# EasyEDA Pro project Class D amp.eprj, board PCB1
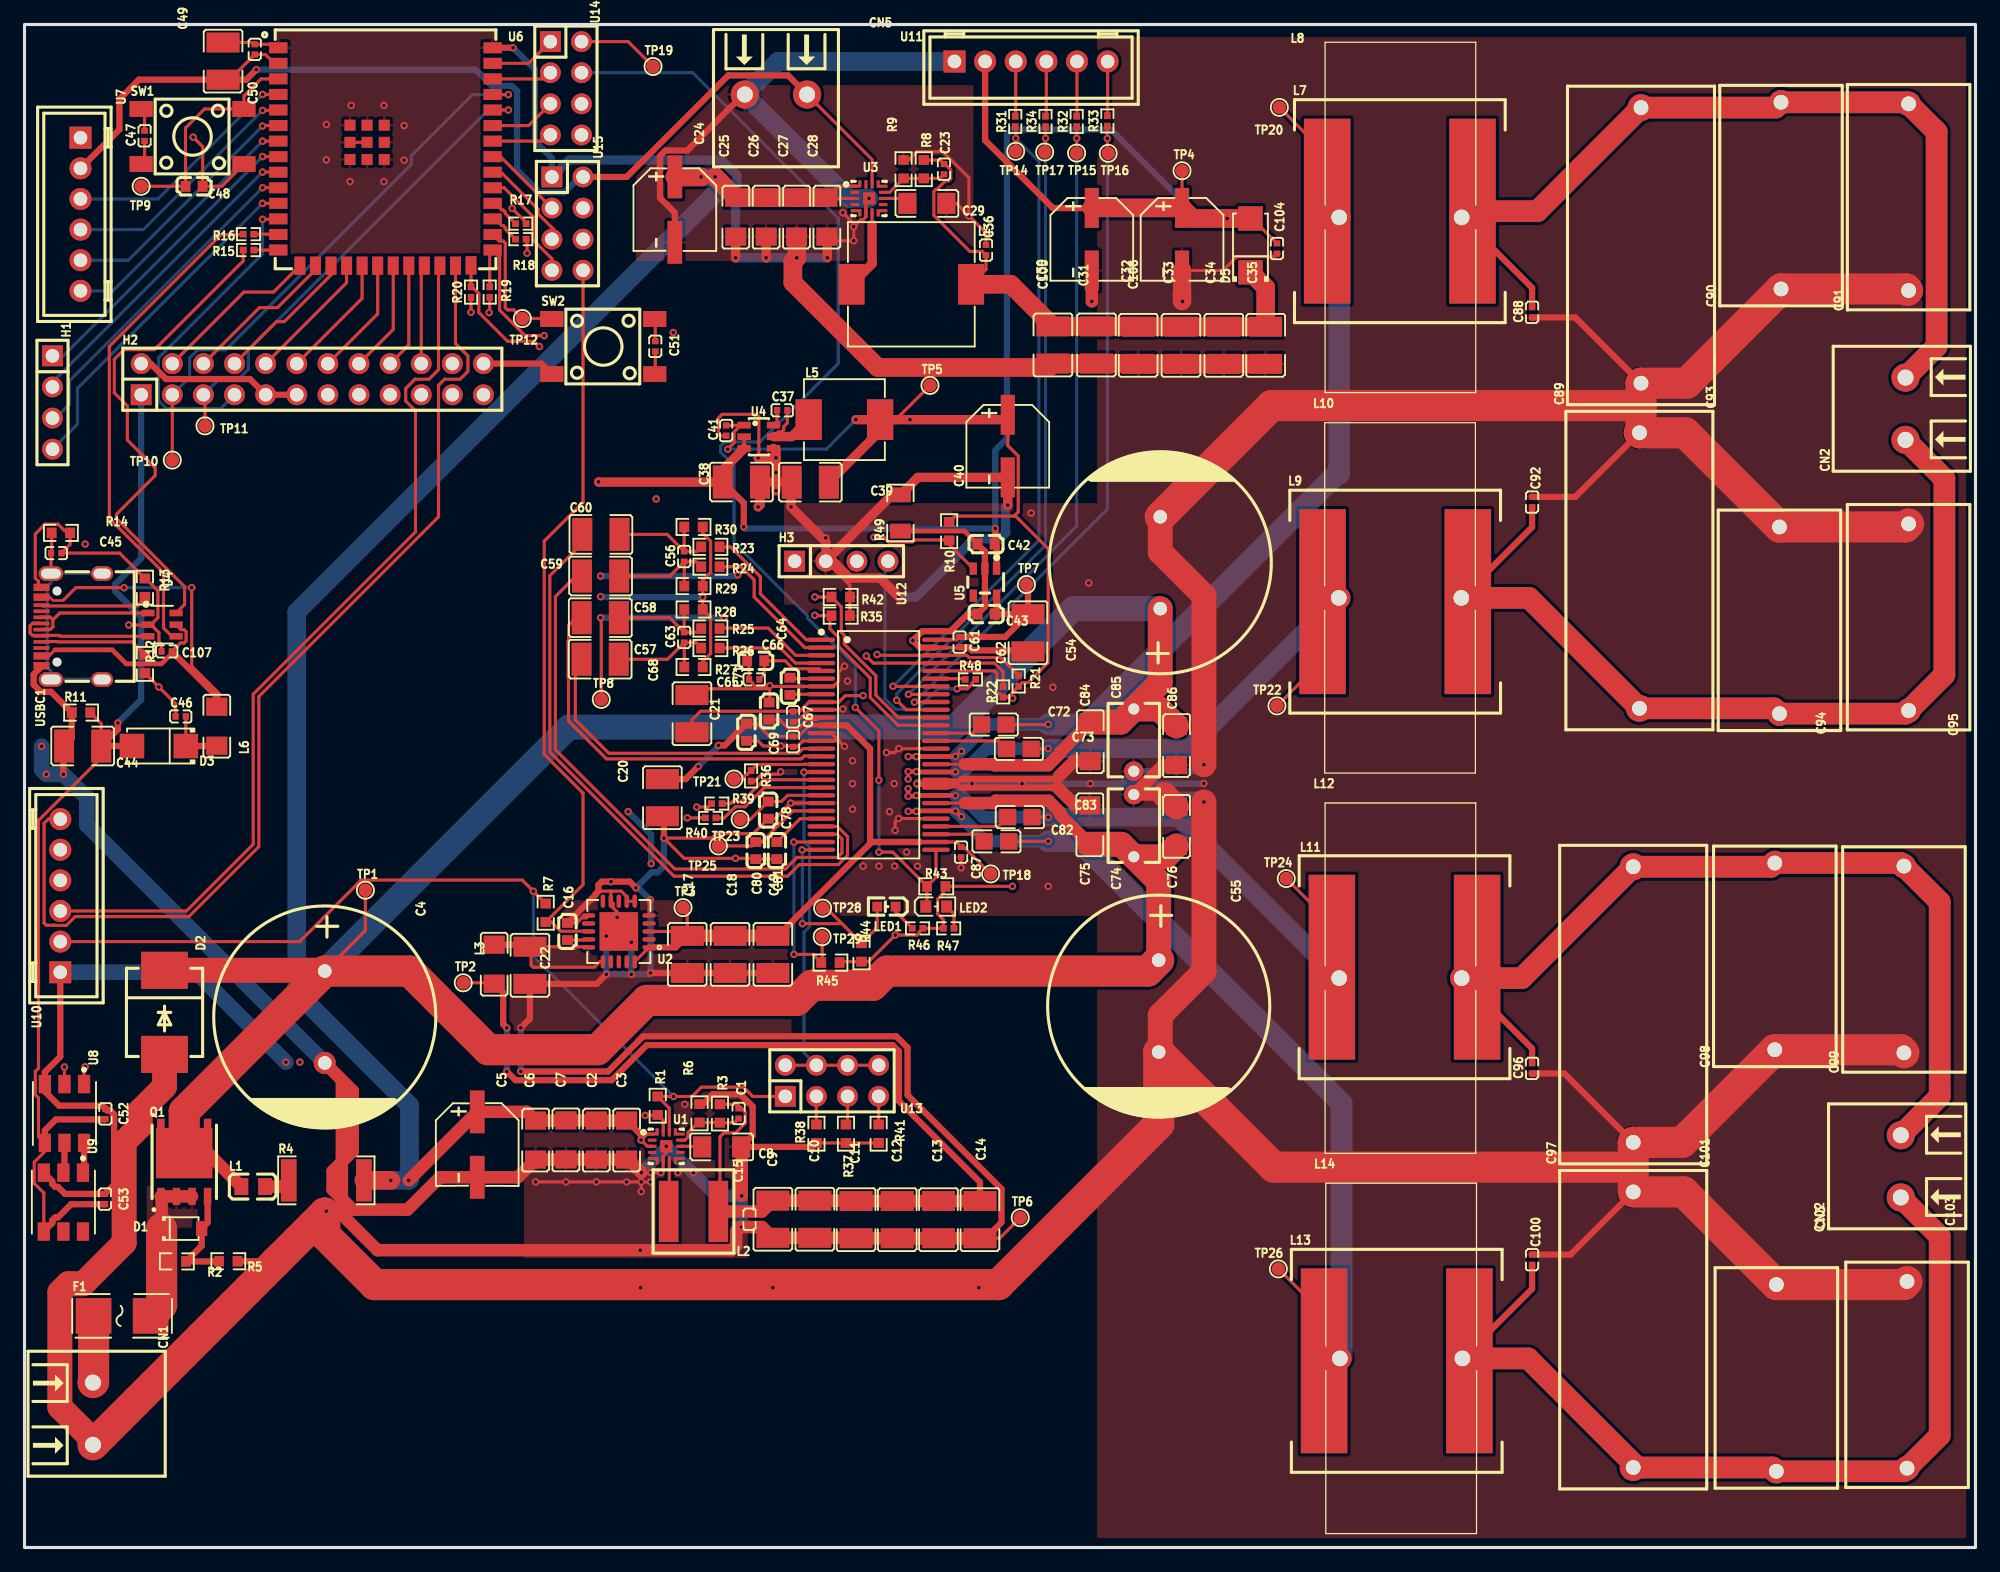
[diagram p6: board, top side]
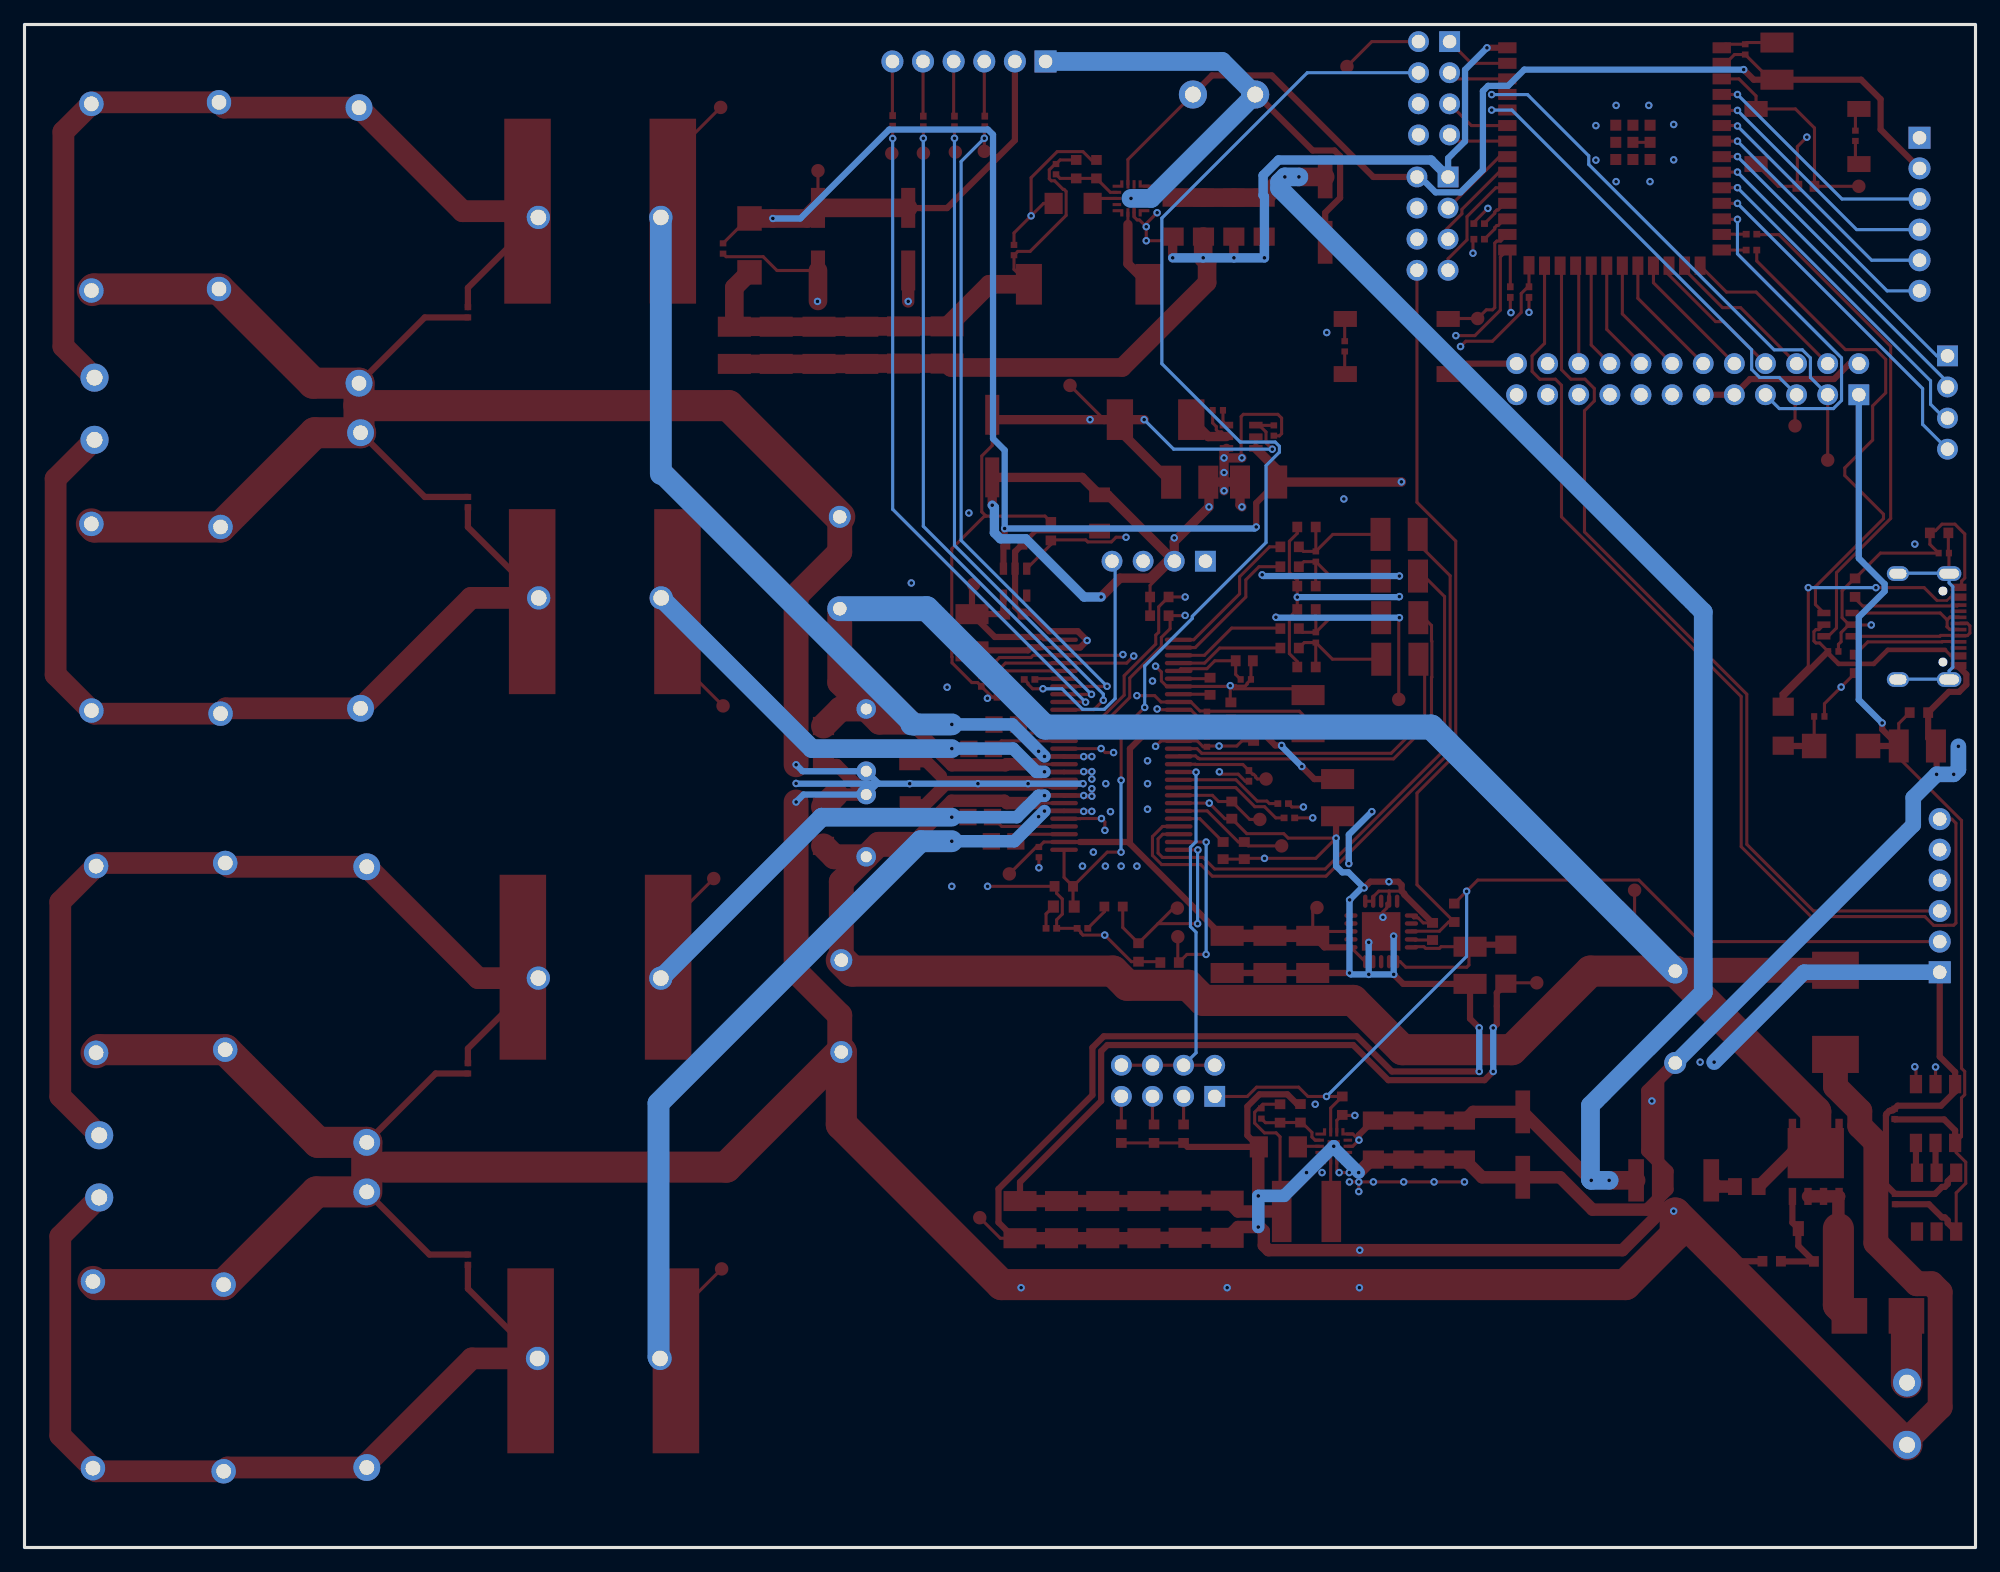
[diagram p7: board, bottom side, seen from below]

Outline 159.26 x 124.33 mm; copper layers: Top Layer, Inner1, Inner2, Bottom Layer. Coordinates in mm from the lower left corner of the outline.
Outline path: rectangle 0,124.33 159.26,0
Stack: Top Layer 0.07mm Outer layer thickness 1oz / Dielectric1 0.2104mm 7628 RC49% 8.6mil / Inner1 0.0152mm Inner layer thickness / Dielectric2 1.065mm 1.1mm H/HOZ Copper / Inner2 0.0152mm Inner layer thickness / Dielectric3 0.2104mm 7628 RC49% 8.6mil / Bottom Layer 0.07mm Outer layer thickness 1oz

## Design rules (mm)
net DSP_SCL: DP2
net DSP_SDA: DP2
net USBD+: DP1
net USBD-: DP1
net L_CKI: DP3
net L_SDI: DP3
template: Custom Config
spacing copperThickness1oz: track to track 0.102, other pairs 0.152 to 0.3
spacing copperThickness2oz (default): track to track 0.203, other pairs 0.152 to 0.3
spacing copperThicknessInner0.5oz: track to track 0.089, other pairs 0.152 to 0.3
track width copperThickness1oz: min 0.102, default 0.254, max 2.54
track width copperThickness2oz: min 0.203, default 0.254, max 2.54
track width copperThickness0.5oz (default): min 0.089, default 0.254, max 2.54
differential pair differentialPair (default): width min 0.127, default 0.254, max 2.54; gap min 0.152, default 0.152
via viaSize (default): diameter min 0.3, default 0.61, max 10; hole min 0.2, default 0.305, max 6.3

## Placement (name value [footprint] x y rotation side)
C1  10pF  [C0402]  58.29 35.43 90 top
C2  2.2uF  [C1206]  46.67 33.26 270 top
C3  2.2uF  [C1206]  49.15 33.26 270 top
C4  2200uF  [CAP-TH_BD18.0-P7.5-D0.8-FD]  24.51 43.31 270 top
C5  47uF  [CAP-SMD_BD6.3-L6.6-W6.6-LS7.2-FD]  36.96 32.89 270 top
C6  2.2uF  [C1206]  41.72 33.26 270 top
C7  2.2uF  [C1206]  44.2 33.27 270 top
C8  1uF  [C1206]  56.91 32.7 0 top
C9  10uF  [C1210]  61.09 26.8 270 top
C10  10uF  [C1210]  64.52 26.8 270 top
C11  10uF  [C1210]  67.88 26.77 270 top
C12  10uF  [C1210]  71.24 26.77 270 top
C13  10uF  [C1210]  74.61 26.77 270 top
C14  10uF  [C1210]  78 26.77 270 top
C15  100nF  [C0402]  59.18 26.8 90 top
C16  1uF  [C0603]  44.32 50.29 90 top
C17  10uF  [C1210]  54.1 48.42 270 top
C18  10uF  [C1210]  57.59 48.42 270 top
C19  10uF  [C1210]  61.09 48.42 270 top
C20  10uF  [C1210]  52.07 61.21 270 top
C21  1uF  [C0603]  58.93 66.55 270 top
C22  10uF  [C1210]  41.26 47.53 270 top
C23  10pF  [C0402]  75.06 112.52 90 top
C24  47uF  [CAP-SMD_BD6.3-L6.6-W6.6-LS7.2-FD]  53.09 109.22 270 top
C25  2.2uF  [C1206]  58.06 108.61 270 top
C26  2.2uF  [C1206]  60.54 108.61 270 top
C27  2.2uF  [C1206]  63.02 108.61 270 top
C28  2.2uF  [C1206]  65.5 108.61 270 top
C29  1uF  [C1206]  73.66 109.73 0 top
C30  10uF  [C1210]  83.95 98.17 270 top
C31  10uF  [C1210]  87.5 98.17 270 top
C32  10uF  [C1210]  90.91 98.14 270 top
C33  10uF  [C1210]  94.4 98.14 270 top
C34  10uF  [C1210]  97.9 98.14 270 top
C35  10uF  [C1210]  101.31 98.14 270 top
C36  100nF  [C0402]  78.49 105.92 270 top
C37  100nF  [C0402]  61.85 92.84 0 top
C38  10uF  [C1210]  58.52 86.98 0 top
C39  10uF  [C1210]  64.14 86.97 180 top
C40  47uF  [CAP-SMD_BD6.3-L6.6-W6.6-RD]  80.26 89.92 90 top
C41  100nF  [C0402]  57.28 91.19 90 top
C42  1uF  [C0603]  78.49 81.91 180 top
C43  1uF  [C0603]  78.5 76.2 180 top
C44  10uF  [C1210]  4.75 65.43 180 top
C45  100pF  [C0402]  2.59 81.18 180 top
C46  100nF  [C0402]  12.75 67.84 0 top
C47  100nF  [C0402]  9.8 115.25 90 top
C48  1uF  [C0603]  13.84 111.12 180 top
C49  100nF  [C0402]  18.8 122.3 270 top
C50  10uF  [C1210]  16.21 121.34 90 top
C51  100nF  [C0402]  51.49 98.06 90 top
C52  100nF  [C0402]  6.6 35.4 90 top
C53  100nF  [C0402]  6.56 28.44 90 top
C54  2200uF  [CAP-TH_BD18.0-P7.5-D0.8-FD]  92.71 80.39 90 top
C55  2200uF  [CAP-TH_BD18.0-P7.5-D0.8-FD]  92.58 44.2 270 top
C56  1nF  [C0402]  53.85 80.9 90 top
C57  10uF  [C1210]  46.99 72.52 0 top
C58  10uF  [C1210]  47 75.91 0 top
C59  10uF  [C1210]  47.03 79.31 0 top
C60  10uF  [C1210]  47.05 82.71 0 top
C61  100nF  [C0402]  76.33 73.91 90 top
C62  10uF  [C1210]  81.92 74.68 90 top
C63  1nF  [C0402]  53.85 74.3 90 top
C64  1uF  [C0603]  62.48 70.31 270 top
C65  100nF  [C0402]  59.56 70.87 0 top
C66  1uF  [C0603]  59.69 72.39 0 top
C67  100nF  [C0402]  62.74 67.82 90 top
C68  10uF  [C1210]  54.48 68.07 270 top
C69  100nF  [C0402]  62.74 65.79 90 top
C71  1uF  [C0603]  60.78 68.29 270 top
C72  33nF  [C0805]  79.12 67.18 180 top
C73  33nF  [C0805]  81.17 65.19 180 top
C74  1uF  [CAP-TH_L5.9-W4.2-P5.08-D0.5]  90.55 58.93 90 top
C75  2.2uF  [C1206]  86.96 59 90 top
C76  2.2uF  [C1206]  94.04 58.87 90 top
C78  1uF  [C0603]  60.71 60.2 90 top
C80  1uF  [C0603]  59.69 56.9 90 top
C81  22nF  [C0603]  61.42 56.9 90 top
C82  33nF  [C0805]  79.34 57.65 180 top
C83  33nF  [C0805]  81.24 59.63 180 top
C84  2.2uF  [C1206]  87 65.79 90 top
C85  1uF  [CAP-TH_L5.9-W4.2-P5.08-D0.5]  90.55 65.91 90 top
C86  2.2uF  [C1206]  94.04 65.47 90 top
C87  100nF  [C0402]  76.45 56.77 90 top
C88  1nF  [C0402]  123.06 100.84 90 top
C89  680nF  [CAP-TH_L26.0-W12.0-P22.50-D0.8]  131.95 106.3 90 top
C90  150nF  [CAP-TH_L18.0-W10.0-P15.00-D1.2]  143.38 110.36 90 top
C91  220nF  [CAP-TH_L18.3-W10.0-P15.00-D1.0]  153.8 110.24 90 top
C92  1nF  [C0402]  123.06 85.34 270 top
C93  680nF  [CAP-TH_L26.0-W12.0-P22.50-D0.8]  131.83 79.76 270 top
C94  150nF  [CAP-TH_L18.0-W10.0-P15.00-D1.2]  143.26 75.69 270 top
C95  220nF  [CAP-TH_L18.3-W10.0-P15.00-D1.0]  153.8 75.95 270 top
C96  1nF  [C0402]  123.06 39.12 90 top
C97  680nF  [CAP-TH_L26.0-W12.0-P22.50-D0.8]  131.32 44.32 90 top
C98  150nF  [CAP-TH_L18.0-W10.0-P15.00-D1.2]  142.88 48.26 90 top
C99  220nF  [CAP-TH_L18.3-W10.0-P15.00-D1.0]  153.42 48.01 90 top
C100  1nF  [C0402]  123.06 23.5 270 top
C101  680nF  [CAP-TH_L26.0-W12.0-P22.50-D0.8]  131.32 17.78 270 top
C102  150nF  [CAP-TH_L18.0-W10.0-P15.00-D1.2]  143 13.84 270 top
C103  220nF  [CAP-TH_L18.3-W10.0-P15.00-D1.0]  153.67 14.1 270 top
C104  100nF  [C0402]  102.24 106.05 90 top
C105  47uF  [CAP-SMD_BD6.3-L6.6-W6.6-RD]  87.12 106.81 90 top
C106  47uF  [CAP-SMD_BD6.3-L6.6-W6.6-RD]  94.49 106.81 90 top
C107  100nF  [C0402]  11.61 73.15 0 top
CN1  1711725  [CONN-TH_MKDS3-2-5.08]  5.59 10.92 270 top
CN2  1711725  [CONN-TH_MKDS3-2-5.08]  153.54 92.96 90 top
CN3  1711725  [CONN-TH_MKDS3-2-5.08]  153.16 31.12 90 top
CN5  1711725  [CONN-TH_MKDS3-2-5.08]  61.34 118.62 180 top
D1  MMSZ15T1G  [SOD-123_L2.7-W1.6-LS3.7-RD]  12.83 26.03 0 top
D2  SMCJ36A  [SMC_L7.1-W6.2-LS8.1-RD]  11.43 43.69 270 top
D3  SS34  [SMA_L4.3-W2.6-LS5.2-RD]  10.97 65.43 180 top
D4  USBLC6-2SC6  [SOT-23-6_L2.9-W1.6-P0.95-LS2.8-BL]  11.23 75.34 270 top
D5  SS34  [SMA_L4.3-W2.6-LS5.2-RD]  100.08 106.3 90 top
F1  0451005.MRL  [FUSE-SMD_L6.1-W2.6]  7.97 18.91 0 top
H1  PH2.54-1X4P-H25  [HDR-TH_4P-P2.54-V-M]  2.29 93.47 270 top
H2  PZ254V-12-24P  [HDR-TH_24P-P2.54-V-M-R2-C12-S2.54]  23.5 95.38 0 top
H3  PH2.54-1X4P-H25  [HDR-TH_4P-P2.54-V-M]  66.68 80.52 0 top
L1  BLM21PG300SN1D  [L0805]  18.67 29.46 0 top
L2  10uH  [IND-SMD_L6.7-W6.5]  54.61 27.43 180 top
L3  BLM31PG121SN1L  [L1206]  38.34 47.62 270 top
L4  4.7uH  [IND-SMD_L10.2-W10.0]  72.39 103.12 0 top
L5  6.8uH  [IND-SMD_L7.1-W6.6]  66.93 92.08 0 top
L6  BLM31PG121SN1L  [L1206]  15.7 67.05 90 top
L7  -  [IND-SMD_L17.2-W18.2]  112.27 109.09 0 top
L8  -  [MA5172AE]  107.31 108.58 0 top
L9  -  [IND-SMD_L17.2-W18.2]  111.89 77.22 0 top
L10  -  [MA5172AE]  107.28 77.52 0 top
L11  -  [IND-SMD_L17.2-W18.2]  112.65 47.37 0 top
L12  -  [MA5172AE]  107.31 46.48 0 top
L13  -  [IND-SMD_L17.2-W18.2]  112.01 15.24 0 top
L14  -  [MA5172AE]  107.38 15.44 0 top
LED1  KT-0603R  [LED-SMD_L1.6-W0.8-R-RD]  70.36 52.32 180 top
LED2  YLED0603YG  [LED0603-FD]  74.42 52.32 180 top
Q1  E38P100KH  [DFN-8_L6.0-W5.0-P1.27-LS6.2-BL_VBQA2309]  13.04 31.48 0 top
R1  100kΩ  [R0603]  51.69 36.07 90 top
R2  100kΩ  [R0603]  12.44 23.35 180 top
R3  100kΩ  [R0603]  56.77 35.43 90 top
R4  500mΩ  [R2512]  24.64 29.97 0 top
R5  47kΩ  [R0603]  16.64 23.37 180 top
R6  8.2kΩ  [R0603]  55.1 35.45 270 top
R7  100kΩ  [R0603]  42.55 51.82 90 top
R8  49.9kΩ  [R0603]  73.41 112.52 90 top
R9  12.4kΩ  [R0603]  71.75 112.52 270 top
R10  100kΩ  [R0603]  75.48 82.97 90 top
R11  1MΩ  [R0603]  4.62 68.16 0 top
R12  5.1kΩ  [R0603]  9.83 72.14 270 top
R13  5.1kΩ  [R0603]  9.83 78.36 90 top
R14  1MΩ  [R0603]  2.97 82.83 180 top
R15  27Ω  [R0402]  18.29 105.92 0 top
R16  27Ω  [R0402]  18.29 107.22 180 top
R17  27Ω  [R0402]  40.51 108.08 180 top
R18  27Ω  [R0402]  40.51 106.81 180 top
R19  22Ω  [R0402]  37.97 102.49 90 top
R20  22Ω  [R0402]  36.45 102.49 90 top
R21  6.8kΩ  [R0402]  81.15 70.74 90 top
R22  6.8kΩ  [R0402]  79.88 69.85 270 top
R23  499Ω  [R0603]  55.99 81.69 0 top
R24  499Ω  [R0603]  55.99 80.07 0 top
R25  499Ω  [R0603]  55.99 75.02 0 top
R26  499Ω  [R0603]  55.99 73.43 0 top
R27  100kΩ  [R0603]  54.61 71.88 180 top
R28  100kΩ  [R0603]  54.61 76.58 180 top
R29  100kΩ  [R0603]  54.61 78.49 180 top
R30  100kΩ  [R0603]  54.61 83.31 180 top
R31  22Ω  [R0402]  80.87 116.42 90 top
R32  22Ω  [R0402]  85.89 116.42 90 top
R33  22Ω  [R0402]  88.39 116.46 90 top
R34  22Ω  [R0402]  83.34 116.42 90 top
R35  10kΩ  [R0603]  66.62 76.07 180 top
R36  27kΩ  [R0402]  59.31 62.99 90 top
R37  20kΩ  [R0603]  67.06 33.78 90 top
R38  10kΩ  [R0603]  64.64 33.78 90 top
R39  22Ω  [R0402]  56.52 60.73 0 top
R40  22Ω  [R0402]  56.01 59.56 0 top
R41  30kΩ  [R0603]  69.72 33.78 90 top
R42  10kΩ  [R0603]  66.62 77.6 0 top
R43  10kΩ  [R0603]  74.42 53.97 0 top
R44  10kΩ  [R0603]  68.33 48.58 270 top
R45  10kΩ  [R0603]  65.79 47.75 0 top
R46  560Ω  [R0402]  72.9 50.55 0 top
R47  560Ω  [R0402]  75.44 50.55 180 top
R48  22Ω  [R0402]  77.22 70.87 0 top
R49  0Ω  [R1206]  71.5 84.45 90 top
SW1  PTS645SM43SMTR92LFS  [KEY-SMD_4P-L6.0-W6.0-P4.50-LS9.0]  13.72 115.19 0 top
SW2  PTS645SM43SMTR92LFS  [KEY-SMD_4P-L6.0-W6.0-P4.50-LS9.0]  47.24 98.04 0 top
TP1  -  [TESTPOINT-SMD_1P-BD1.0]  27.83 53.66 0 top
TP2  -  [TESTPOINT-SMD_1P-BD1.0]  35.81 46.1 0 top
TP3  -  [TESTPOINT-SMD_1P-BD1.0]  53.76 52.24 0 top
TP4  -  [TESTPOINT-SMD_1P-BD1.0]  94.49 112.39 0 top
TP5  -  [TESTPOINT-SMD_1P-BD1.0]  73.91 94.87 0 top
TP6  -  [TESTPOINT-SMD_1P-BD1.0]  81.28 26.92 0 top
TP7  -  [TESTPOINT-SMD_1P-BD1.0]  81.79 78.61 0 top
TP8  -  [TESTPOINT-SMD_1P-BD1.0]  47.08 69.24 0 top
TP9  -  [TESTPOINT-SMD_1P-BD1.0]  9.53 111.12 0 top
TP10  -  [TESTPOINT-SMD_1P-BD1.0]  12.07 88.77 0 top
TP11  -  [TESTPOINT-SMD_1P-BD1.0]  14.73 91.57 0 top
TP12  -  [TESTPOINT-SMD_1P-BD1.0]  40.64 100.33 0 top
TP14  -  [TESTPOINT-SMD_1P-BD1.0]  80.91 113.98 0 top
TP15  -  [TESTPOINT-SMD_1P-BD1.0]  85.88 113.84 0 top
TP16  -  [TESTPOINT-SMD_1P-BD1.0]  88.46 113.82 0 top
TP17  -  [TESTPOINT-SMD_1P-BD1.0]  83.28 113.92 0 top
TP18  -  [TESTPOINT-SMD_1P-BD1.0]  78.87 54.99 0 top
TP19  -  [TESTPOINT-SMD_1P-BD1.0]  51.31 120.9 0 top
TP20  -  [TESTPOINT-SMD_1P-BD1.0]  102.43 117.57 0 top
TP21  -  [TESTPOINT-SMD_1P-BD1.0]  57.91 62.74 0 top
TP22  -  [TESTPOINT-SMD_1P-BD1.0]  102.24 68.71 0 top
TP23  -  [TESTPOINT-SMD_1P-BD1.0]  58.42 59.44 0 top
TP24  -  [TESTPOINT-SMD_1P-BD1.0]  103 54.61 0 top
TP25  -  [TESTPOINT-SMD_1P-BD1.0]  56.64 57.28 0 top
TP26  -  [TESTPOINT-SMD_1P-BD1.0]  102.35 22.74 0 top
TP28  -  [TESTPOINT-SMD_1P-BD1.0]  65.15 52.2 0 top
TP29  -  [TESTPOINT-SMD_1P-BD1.0]  65.12 49.86 0 top
U1  LMQ66430MC3RXBRQ1  [VQFN-14_L2.6-W2.6-P0.50-BL]  52.39 32.75 0 top
U2  TPS7A4701RGWR  [VQFN-20_L5.0-W5.0-P0.65-TL-EP]  48.51 50.29 180 top
U3  LMQ66430MC3RXBRQ1  [VQFN-14_L2.6-W2.6-P0.50-BL]  68.94 110.13 0 top
U4  AP63203WU-7  [TSOT-26_L2.9-W1.6-P0.95-LS2.8-BL]  59.94 90.68 270 top
U5  TPS7A2033PDBVR  [SOT-23-5_L2.9-W1.6-P0.95-LS2.8-BR]  78.4 78.81 90 top
U6  2.4GHz  [WIRELM-SMD_ESP32-S3-WROOM-1U]  29.46 113.54 0 top
U7  B6B-XH-A(LF)(SN)  [CONN-TH_6P-P2.50_B6B-XH-A-LF-SN]  4.57 108.84 270 top
U8  SK9822  [SMD_6P-L5.0-W5.0-TL]  3.26 35.43 270 top
U9  SK9822  [SMD_6P-L5.0-W5.0-TL]  3.18 28.19 270 top
U10  B6B-XH-A(LF)(SN)  [CONN-TH_6P-P2.50_B6B-XH-A-LF-SN]  2.92 53.21 90 top
U11  B6B-XH-A(LF)(SN)  [CONN-TH_6P-P2.50_B6B-XH-A-LF-SN]  82.16 121.32 0 top
U12  TAS3251DKQR  [SSOP-56_L18.5-W7.6-P0.63-LS10.7-BL]  69.72 65.53 270 top
U13  PZ2.54-2*4  [HDR-TH_8P-P2.54-V-M-R2-C4-S2.54]  65.91 38.1 0 top
U14  PZ2.54-2*4  [HDR-TH_8P-P2.54-V-M-R2-C4-S2.54]  44.2 119.13 270 top
U15  PZ2.54-2*4  [HDR-TH_8P-P2.54-V-M-R2-C4-S2.54]  44.32 108.08 270 top
USBC1  TYPE-C-31-M-12  [USB-C_SMD-TYPE-C-31-M-12_1]  3.86 75.18 90 top

## Footprints (pads in the part's own frame, mm; a bottom-side part is the same pattern mirrored in y, then rotated)
C0402
  rect 0.5x0.54 smd: 1(-0.42,0) 2(0.42,0)
C0603
  rect 0.8x0.9 smd: 1(-0.7,0) 2(0.7,0)
C0805
  rect 1.41x1.35 smd: 1(-1,0) 2(1,0)
C1206
  rect 1.485x1.728 smd: 1(-1.593,0) 2(1.593,0)
C1210
  rect 1.635x2.7 smd: 1(-1.518,0) 2(1.518,0)
CAP-SMD_BD6.3-L6.6-W6.6-LS7.2-FD
  rect 3.5x1.2 smd: 1(-2.67,0) 2(2.67,0)
CAP-SMD_BD6.3-L6.6-W6.6-RD
  rect 3.26x1.15 smd: 1(2.555,0) 2(-2.555,0)
CAP-TH_BD18.0-P7.5-D0.8-FD
  round 1.8 hole 1.1: 1(-3.75,0) 2(3.75,0)
CAP-TH_L5.9-W4.2-P5.08-D0.5
  round 1.6 hole 0.9: 1(-2.54,0) 2(2.54,0)
CAP-TH_L18.0-W10.0-P15.00-D1.2
  round 2 hole 1.2: 1(-7.62,0) 2(7.62,0)
CAP-TH_L18.3-W10.0-P15.00-D1.0
  round 2 hole 1.2: 1(-7.62,0) 2(7.62,0)
CAP-TH_L26.0-W12.0-P22.50-D0.8
  round 2.2 hole 1.2: 1(-11.249,0) 2(11.249,0)
CONN-TH_6P-P2.50_B6B-XH-A-LF-SN
  rect 1.8x1.8 hole 1.1: 1(-6.251,0.001)
  round 1.8 hole 1.1: 2(-3.749,-0.001) 3(-1.249,-0.001) 4(1.251,-0.001) 5(3.751,-0.001) 6(6.251,-0.001)
CONN-TH_MKDS3-2-5.08
  round 2.3 hole 1.3: 1(-2.54,0) 2(2.54,0)
DFN-8_L6.0-W5.0-P1.27-LS6.2-BL_VBQA2309
  rect 0.61x1.397 smd: 1(-1.905,-2.82) 2(-0.635,-2.82) 3(0.635,-2.82) 4(1.905,-2.82) 5(1.905,2.82) 6(0.635,2.82) 7(-0.635,2.82) 8(-1.905,2.82)
  rect 4.6x4.1 smd: 9(0,0.711)
FUSE-SMD_L6.1-W2.6
  rect 2.91x2.91 smd: 1(-2.33,0) 2(2.33,0)
HDR-TH_4P-P2.54-V-M
  rect 1.7x1.7 hole 1.1: 1(-3.81,0)
  round 1.7 hole 1.1: 2(-1.27,0) 3(1.27,0) 4(3.81,0)
HDR-TH_8P-P2.54-V-M-R2-C4-S2.54
  rect 1.7x1.7 hole 1.1: 1(-3.81,-1.27)
  round 1.7 hole 1.1: 2(-3.81,1.27) 3(-1.27,-1.27) 4(-1.27,1.27) 5(1.27,-1.27) 6(1.27,1.27) 7(3.81,-1.27) 8(3.81,1.27)
HDR-TH_24P-P2.54-V-M-R2-C12-S2.54
  rect 1.7x1.7 hole 1.1: 1(-13.97,-1.27)
  round 1.7 hole 1.1: 2(-13.97,1.27) 3(-11.43,-1.27) 4(-11.43,1.27) 5(-8.89,-1.27) 6(-8.89,1.27) 7(-6.35,-1.27) 8(-6.35,1.27) 9(-3.81,-1.27) 10(-3.81,1.27) 11(-1.27,-1.27) 12(-1.27,1.27) 13(1.27,-1.27) 14(1.27,1.27) 15(3.81,-1.27) 16(3.81,1.27) 17(6.35,-1.27) 18(6.35,1.27) 19(8.89,-1.27) 20(8.89,1.27) 21(11.43,-1.27) 22(11.43,1.27) 23(13.97,-1.27) 24(13.97,1.27)
IND-SMD_L6.7-W6.5
  rect 1.6x5 smd: 1(-2.025,0) 2(2.025,0)
IND-SMD_L7.1-W6.6
  rect 2.15x3.32 smd: 1(-2.913,0) 2(2.913,0)
IND-SMD_L10.2-W10.0
  rect 2.124x3.32 smd: 1(4.878,0) 2(-4.878,0)
IND-SMD_L17.2-W18.2
  rect 3.8x15.1 smd: 1(-5.93,0) 2(5.93,0)
KEY-SMD_4P-L6.0-W6.0-P4.50-LS9.0
  rect 1.9x1.3 smd: 1(-4.2,2.25) 2(4.2,2.25) 3(-4.2,-2.25) 4(4.2,-2.25)
L0805
  rect 1.133x1.377 smd: 1(-0.966,0) 2(0.966,0)
L1206
  rect 1.485x1.728 smd: 1(-1.593,0) 2(1.593,0)
LED0603-FD
  rect 0.9x1 smd: 1(-0.85,0) 2(0.85,0)
LED-SMD_L1.6-W0.8-R-RD
  rect 0.8x0.8 smd: 1(0.75,0) 2(-0.75,0)
MA5172AE
  round 1.905 hole 1.27: 1(0,0) 2(10,0)
R0402
  rect 0.566x0.54 smd: 1(-0.433,0) 2(0.433,0)
R0603
  rect 0.806x0.864 smd: 1(-0.753,0) 2(0.753,0)
R1206
  rect 1.208x1.701 smd: 1(-1.479,0) 2(1.479,0)
R2512
  rect 1.282x3.456 smd: 1(-3.067,0) 2(3.067,0)
SMA_L4.3-W2.6-LS5.2-RD
  rect 2x2 smd: 1(-2.2,0) 2(2.2,0)
SMC_L7.1-W6.2-LS8.1-RD
  rect 3.03x3.82 smd: 1(-3.435,0) 2(3.435,0)
SMD_6P-L5.0-W5.0-TL
  rect 1.5x1 smd: 1(-2.4,1.6) 2(-2.4,0) 3(-2.4,-1.6) 4(2.4,-1.6) 5(2.4,0) 6(2.4,1.6)
SOD-123_L2.7-W1.6-LS3.7-RD
  rect 0.91x1.22 smd: 1(-1.635,0) 2(1.635,0)
SOT-23-5_L2.9-W1.6-P0.95-LS2.8-BR
  rect 1x0.6 smd: 1(1.1,-0.95) 2(1.1,0) 3(1.1,0.95) 4(-1.1,0.95) 5(-1.1,-0.95)
SOT-23-6_L2.9-W1.6-P0.95-LS2.8-BL
  rect 0.532x1.072 smd: 1(-0.95,-1.149) 2(0,-1.149) 3(0.95,-1.149) 4(0.95,1.149) 5(0,1.149) 6(-0.95,1.149)
SSOP-56_L18.5-W7.6-P0.63-LS10.7-BL
  oval 0.355x2.267 smd: 1(-8.572,-4.678) 2(-7.938,-4.678) 3(-7.303,-4.678) 4(-6.668,-4.678) 5(-6.032,-4.678) 6(-5.397,-4.678) 7(-4.763,-4.678) 8(-4.128,-4.678) 9(-3.493,-4.678) 10(-2.857,-4.678) 11(-2.223,-4.678) 12(-1.587,-4.678) 13(-0.953,-4.678) 14(-0.318,-4.678) 15(0.318,-4.678) 16(0.953,-4.678) 17(1.587,-4.678) 18(2.223,-4.678) 19(2.857,-4.678) 20(3.493,-4.678) 21(4.128,-4.678) 22(4.763,-4.678) 23(5.397,-4.678) 24(6.032,-4.678) 25(6.668,-4.678) 26(7.303,-4.678) 27(7.938,-4.678) 28(8.572,-4.678) 29(8.572,4.678) 30(7.938,4.678) 31(7.303,4.678) 32(6.668,4.678) 33(6.032,4.678) 34(5.397,4.678) 35(4.763,4.678) 36(4.128,4.678) 37(3.493,4.678) 38(2.857,4.678) 39(2.223,4.678) 40(1.587,4.678) 41(0.953,4.678) 42(0.318,4.678) 43(-0.318,4.678) 44(-0.953,4.678) 45(-1.587,4.678) 46(-2.223,4.678) 47(-2.857,4.678) 48(-3.493,4.678) 49(-4.128,4.678) 50(-4.763,4.678) 51(-5.397,4.678) 52(-6.032,4.678) 53(-6.668,4.678) 54(-7.303,4.678) 55(-7.938,4.678) 56(-8.572,4.678)
TESTPOINT-SMD_1P-BD1.0
  round 1.1 smd: 1(0,0)
TSOT-26_L2.9-W1.6-P0.95-LS2.8-BL
  rect 0.55x1.1 smd: 1(-0.95,-1.2) 2(0,-1.2) 3(0.95,-1.2) 4(0.95,1.2) 5(0,1.2) 6(-0.95,1.2)
USB-C_SMD-TYPE-C-31-M-12_1
  oval 1.2x2 hole 0.8x1.6: 1(4.325,1.706) 4(-4.325,1.706)
  oval 1.2x1.8 hole 0.8x1.4: 2(4.325,-2.474) 3(-4.325,-2.474)
  custom 0.6x1.3 smd: A1B12(-3.2,2.474) A4B9(-2.4,2.474) B1A12(3.2,2.474) B4A9(2.401,2.474)
  rect 0.3x1.3 smd: A5(-1.25,2.474) A6(-0.25,2.474) A7(0.25,2.474) A8(1.25,2.474) B5(1.75,2.474) B6(0.75,2.474) B7(-0.75,2.474) B8(-1.75,2.474)
VQFN-14_L2.6-W2.6-P0.50-BL
  custom 0.88x0.6 smd: 1(-1.06,1.005) 5(-1.06,-1) 8(1.06,-1) 12(1.06,1)
  rect 0.7x0.25 smd: 2(-1.15,0.5) 3(-1.15,0) 4(-1.15,-0.5) 9(1.15,-0.5) 10(1.15,0) 11(1.15,0.5)
  rect 0.25x0.7 smd: 6(-0.25,-1.147) 7(0.25,-1.147) 13(0.25,1.147) 14(-0.25,1.147)
  rect 1x1 smd: 15(0,0.003)
VQFN-20_L5.0-W5.0-P0.65-TL-EP
  oval 1.087x0.364 smd: 1(-2.469,1.3) 2(-2.469,0.65) 3(-2.469,0) 4(-2.469,-0.65) 5(-2.469,-1.3) 11(2.469,-1.3) 12(2.469,-0.65) 13(2.469,0) 14(2.469,0.65) 15(2.469,1.3)
  oval 0.364x1.087 smd: 6(-1.3,-2.469) 7(-0.65,-2.469) 8(0,-2.469) 9(0.65,-2.469) 10(1.3,-2.469) 16(1.3,2.469) 17(0.65,2.469) 18(0,2.469) 19(-0.65,2.469) 20(-1.3,2.469)
  rect 3.15x3.15 smd: 21(0,0)
WIRELM-SMD_ESP32-S3-WROOM-1U
  rect 1.5x0.9 smd: 1(-8.75,8.895) 2(-8.75,7.625) 3(-8.75,6.355) 4(-8.75,5.085) 5(-8.75,3.815) 6(-8.75,2.545) 7(-8.75,1.275) 8(-8.75,0.005) 9(-8.75,-1.265) 10(-8.75,-2.535) 11(-8.75,-3.805) 12(-8.75,-5.075) 13(-8.75,-6.345) 14(-8.75,-7.615) 27(8.75,-7.615) 28(8.75,-6.345) 29(8.75,-5.075) 30(8.75,-3.805) 31(8.75,-2.535) 32(8.75,-1.265) 33(8.75,0.005) 34(8.75,1.275) 35(8.75,2.545) 36(8.75,3.815) 37(8.75,5.085) 38(8.75,6.355) 39(8.75,7.625) 40(8.75,8.895)
  rect 0.9x1.5 smd: 15(-6.985,-8.895) 16(-5.715,-8.895) 17(-4.445,-8.895) 18(-3.175,-8.895) 19(-1.905,-8.895) 20(-0.635,-8.895) 21(0.635,-8.895) 22(1.905,-8.895) 23(3.175,-8.895) 24(4.445,-8.895) 25(5.715,-8.895) 26(6.985,-8.865)
  rect 0.9x0.9 smd: 41(-2.9,2.575) 41(-2.9,1.175) 41(-2.9,-0.225) 41(-1.5,2.575) 41(-1.5,1.175) 41(-1.5,-0.225) 41(-0.1,2.575) 41(-0.1,1.175) 41(-0.1,-0.225)

## Nets
As in the schematic, except:
$5N11628: C78.2 TP23.1 U12.21
$5N11697: C80.2 TP25.1 U12.23
$5N12326: C71.2 U12.11

Pads without a net: U1 2 4 5 8 9 12; U2 2 4 8 10 12 17 18 19; U3 2 4 5 8 9 12 14; U5 4; U9 5 6; USBC1 A8 B8

## Via types
v1: diameter 0.61, hole 0.305, Top Layer to Bottom Layer, 208 vias

## Routing (per net, layer and track width the routed paths; a pad name or vN(x,y) marks a point on that pad's centre or on a via; arc(x,y) is an arc through that point)
3.3V: length 402.8
  Top Layer w0.254: 80.26,69.42 R22.2 79.58,69.72 79.5,69.72 79.33,69.88 79.33,70.68 79.37,70.72 79.37,71.37 79.17,71.56 U12.52 ; 80.26,69.42 80.56,69.42 v1(80.65,69.33) ; 80.26,69.42 R21.1 81.46,70.61 81.93,70.61 83.54,72.23 83.54,72.7 83.57,72.72 83.57,81.53 80.9,84.2 80.77,84.2 ; 80.77,84.2 75.96,84.2 R10.2 ; 80.77,84.2 81.12,84.55 81.12,89.11 80.26,89.96 C40.1 ; U4.1 58.47,91.63 58.45,91.61 ; U10.2 22.46,49.46 27.48,54.49 40.63,54.49 v1(41.54,53.57) R7.2 ; 58.45,91.61 C41.2 ; 58.45,91.61 57.92,91.07 57.92,90.17 v1(57.4,89.66) ; v1(80.65,53.97) R43.2 75,53.8 75,53.4 74.54,52.94 74.54,51.71 75,51.25 R47.2 R46.2 73.03,50.24 73.03,50.16 72.86,50 v1(71.08,50) 68.91,47.83 R44.2 66.61,47.83 R45.2 ; U1.13 52.64,35.87 R1.2 v1(52.98,36.82) 54.49,36.82 55.25,37.58 58.69,37.58 59.44,36.82 62.09,36.82 U13.1 ; CN5.1 69.19,113.31 U3.13 ; 71.12,92.08 TP5.1 ; v1(68.45,69.54) 67,69.54 66.48,69.02 U12.9 64.04,69.02 63.31,68.29 62.74,68.29 62.72,68.27 55.19,68.27 54.48,67.56 C68.2 ; 16.74,119.83 C49.2 19.67,121.88 20.39,121.16 20.71,121.16 U6.2
  Top Layer w0.508: U7.2 7.75,115.76 7.75,118.24 9.34,119.83 C50.1 18.1,119.83 v1(18.92,120.65) ; U15.2 49.15,111.89 57.44,120.17 62.33,120.17 CN5.1 ; H2.2 10.29,96.65 11.54,95.39 18.4,95.39 H2.9 H2.11
  Top Layer w0.762: L5.2 69.84,91.15 C39.1 ; L5.2 v1(67.86,92.08) ; L5.2 v1(72.28,92.08) 79.87,92.08 C40.1
  Inner1 w0.254: v1(72.28,92.08) 72.28,110.22 CN5.1 ; v1(80.65,69.33) 80.65,69.32 v1(80.65,53.97)
  Inner1 w1.27: U7.2 9.53,107.63 H2.2
  Inner2 w0.254: U13.1 63.51,38.24 63.51,39.84 64.18,40.5 65.77,40.5 71.08,45.81 v1(71.08,50) ; v1(68.45,69.54) 70.66,71.75 70.66,73.01 72.95,75.3 72.95,91.41 v1(72.28,92.08)
  Bottom Layer w0.254: v1(67.86,92.08) 65.45,89.66 v1(57.4,89.66) ; v1(41.54,53.57) 41.54,48.26 v1(52.98,36.82)
  Bottom Layer w0.508: U15.2 45.33,111.89 44.07,110.63 42.04,110.63 40.21,112.46 40.21,118.91 39.79,119.32 38.16,119.32 36.83,120.65 v1(18.92,120.65)
12V_GVDD: length 68
  Top Layer w0.254: U12.12 64.08,67.12 63.16,66.21 C69.2 62.61,66.21 62.6,66.22 60.78,66.22 59.75,67.25 C21.1 ; TP18.1 76.67,57.19 C87.2 76.05,57.59 U12.30 73.12,57.59 ; U2.20 U2.1 ; TP3.1 54.1,51.89 C17.1 53.74,50.29 U2.3
  Top Layer w0.508: U12.12 67.12,67.12 69.02,65.21 69.02,57.59 ; 69.02,57.59 69.02,57.47 61.49,49.94 61.13,49.94 ; 69.02,57.59 73.12,57.59 ; U2.1 53.16,48.99 C17.1 ; v1(54.99,63.75) 53.97,62.73 C20.1 ; v1(56.64,65.48) 57.16,65.48 58.07,66.39 58.07,66.42 58.31,66.65 58.33,66.65 C21.1
  Top Layer w1.016: C19.1 C18.1 C17.1
  Bottom Layer w0.508: v1(54.99,63.75) 56.64,65.41 v1(56.64,65.48)
+3.3VA: length 15.1
  Top Layer w0.254: U12.56 76.1,74.1 C61.2
  Top Layer w0.508: C62.2 81.92,78.49 TP7.1 ; C62.2 81.91,76.2 C43.1 79.35,76.35 U5.5 ; C62.2 80.06,74.33 C61.2
+5V: length 266.2
  Top Layer w0.254: U9.4 1.58,28.95 0.8,29.73 0.8,31.46 1.58,32.24 1.58,32.94 U8.4 1.14,33.55 1.14,36.7 0.88,36.96 0.88,38.86 1.14,39.12 1.14,59.35 6.27,64.47 C44.1 6.27,67.27 R11.2 ; U4.3 U4.2 ; TP4.1 94.49,109.36 ; C104.2 100.2,108.5
  Top Layer w0.508: C53.1 3.81,28.02 2.73,26.95 2.51,26.95 2.27,26.71 2.27,26.49 U9.4 ; v1(7.62,67.31) 7.62,66.79 C44.1 D3.2 ; C52.1 6.57,34.95 2.56,34.95 1.66,34.05 U8.4 ; v1(79.25,83.19) 79.25,81.98 C42.1 79.35,81.75 79.35,79.91 ; v1(58.71,83.31) 58.71,85.27 C38.1 ; U11.2 78.41,114.88 83.95,109.35 87.11,109.35 87.12,109.36
  Top Layer w0.762: v1(46.86,86.99) 46.88,86.98 C38.1 57,87.99 U4.3
  Top Layer w1.524: D5.2 v1(98.17,108.5) 95.35,108.5 94.49,109.36 87.12,109.36
  Inner1 w0.762: H2.1 16.64,86.99 v1(46.86,86.99)
  Bottom Layer w0.508: H2.1 9.53,80.76 7.42,78.65 7.42,78.06 9.53,75.96 9.53,69.22 v1(7.62,67.31) ; v1(98.17,108.5) 95.93,108.5 88.67,115.76 80.62,115.76 80.2,115.34 80.2,90.53 79.25,89.58 v1(79.25,83.19) 58.84,83.19 v1(58.71,83.31)
+13.2V: length 92.5
  Top Layer w0.254: L2.1 56.64,27.56 56.77,27.69 56.77,33.53 57.09,33.85 58.04,33.85 58.84,34.65 58.84,35.53 58.52,35.85 C1.2 58.29,36.07 58.17,36.19 R3.2 ; TP2.1 38.26,46.1
  Top Layer w0.508: L3.2 39.08,45.29 39.08,42.71 v1(39.37,42.42) ; C14.1 78,29.83 71.37,36.45 71.37,40.51 70.87,41.02 50.8,41.02 47.93,38.15 40.08,38.15 v1(39.37,38.86)
  Top Layer w1.016: L2.1 60.2,27.43 C9.1 C10.1 67.85,28.31 C11.1 C12.1 C13.1 C14.1
  Bottom Layer w0.508: v1(39.37,42.42) v1(39.37,38.86)
AGND: length 101.5
  Top Layer w0.254: U12.55 76.3,73.47 C61.1 ; v1(55.36,77.59) R28.1 56.01,75.94 56.01,72.97 55.36,72.33 R27.1 ; TP8.1 47.08,75.85 v1(47.03,75.91) ; R30.1 55.36,82.79 56.01,82.15 56.01,79.61 55.36,78.97 R29.1 55.36,77.61 55.35,77.6
  Top Layer w0.381: R49.1 76.72,82.98 77.79,81.91
  Top Layer w0.508: 77.79,81.91 78.38,81.32 78.38,81.3 78.4,81.28 78.4,76.83 78.39,76.82 78.39,76.8 77.8,76.2 77.73,76.27 77.07,76.27 75.61,74.8 73.28,74.8 v1(72.52,74.04) 73.09,73.47 U12.55 ; C61.1 77.09,73.49 77.34,73.24 81.83,73.24 C62.1
  Inner1 w0.508: v1(55.36,77.59) 55.47,77.59 v1(57.11,75.94) 59.01,74.04 v1(72.52,74.04)
  Bottom Layer w0.508: v1(55.36,77.59) 47.07,77.59 v1(47.03,77.63) ; v1(57.11,75.94) 57.07,75.91 v1(47.03,75.91) ; v1(58.23,79.41) 58.13,79.31 v1(47.03,79.31) ; v1(49.28,60.07) 51.16,58.19 v1(51.16,55.83)
GND: length 1383.4
  Top Layer w0.254: 49.15,53.14 48.71,53.58 47.87,53.58 ; U12.37 75.56,62.04 ; C41.1 57.26,90.75 56.82,90.75 56.64,90.93 56.64,92.2 56.95,92.51 59.76,92.51 59.94,92.33 59.94,89.01 v1(59.88,88.95) ; v1(51.09,52.87) 50.98,52.76 U2.5 ; v1(70.36,64.9) 71.04,64.9 v1(71.37,65.23) 71.39,65.21 U12.42 ; v1(60.83,70.36) 60.83,69.04 C71.1 ; v1(60.83,70.36) 60.39,70.36 60.35,70.32 59.62,70.32 59.45,70.48 59.45,70.55 C65.1 59.14,72.24 C66.1 ; v1(60.83,70.36) 60.9,70.29 U12.7 66.01,70.29 66.46,70.74 66.46,71.47 v1(66.93,71.95) ; v1(60.83,70.36) 60.58,70.1 54.87,70.1 54.48,69.72 C68.1 ; 1.38,78.41 1.13,78.66 1.13,78.89 0.88,79.14 0.88,82.74 1.68,83.54 2.74,83.54 3.27,83.01 3.55,83.01 R14.1 3.72,81.89 C45.1 7.76,81.18 R13.2 9.88,79.11 10.89,78.1 10.89,75.91 10.32,75.34 10.97,74.69 10.97,73.95 11.19,73.73 11.19,73.15 ; U12.22 v1(62.55,60.77) 61.28,59.5 C78.1 59.48,58.27 56.47,58.27 56.1,57.91 v1(52.2,57.91) 53.85,56.26 v1(58.04,56.26) 59.62,56.26 C80.1 C81.1 ; C29.2 76.07,109.73 v1(77.09,108.71) ; v1(66.93,65.41) 66.48,65.85 ; 66.48,65.85 65.85,66.48 U12.13 ; 66.48,65.85 U12.14 63.53,65.85 63.05,65.37 C69.1 62.67,65.43 v1(61.75,65.43) 60.3,65.43 59.88,65.85 C21.2 ; v1(50.34,29.84) 50.35,29.85 v1(50.35,30.61) v1(51.12,30.61) v1(51.94,30.61) 52.14,30.8 U1.6 52.14,31.97 52.39,32.23 v1(52.39,32.76) ; v1(50.34,29.84) 50.34,29.84 v1(50.34,29.06) ; v1(50.34,29.84) v1(49.15,29.84) v1(46.68,29.84) v1(44.2,29.84) v1(41.72,29.84) ; v1(50.34,29.84) v1(51.11,29.84) ; C104.1 101.99,105.38 98.96,105.38 97.83,104.25 C106.2 ; 78.46,25.25 79.6,25.25 TP6.1 ; C16.2 45.08,50.99 45.49,51.4 45.86,51.4 U2.11 ; v1(67.69,107.82) v1(67.69,106.68) 65.83,106.68 65.53,106.98 ; v1(67.69,107.82) 68.25,108.38 68.43,108.38 68.69,108.63 U3.6 68.69,109.71 68.94,109.96 v1(68.94,110.13) ; v1(67.69,107.82) 67.69,108.08 v1(66.8,108.97) ; v1(8.51,75.31) 10.05,75.31 10.08,75.34 ; v1(61.72,63.32) 61.53,63.13 60.18,63.13 59.61,62.56 R36.1 ; v1(71.07,58.55) 71.07,59.23 v1(71.35,59.51) 73.08,59.51 73.09,59.5 U12.33 ; C46.1 12.33,68.88 v1(10.97,70.24) R12.2 ; v1(77.09,108.71) 77.09,111.82 74.96,113.96 72.86,113.96 72.18,113.28 R9.1 ; v1(77.09,108.71) 78.49,107.31 C36.1 ; 75.56,62.67 U12.38 ; U2.7 U2.6 ; U6.41 U6.41 ; 47.87,53.58 46.84,53.58 ; 47.87,53.58 47.86,53.58 U2.9 48.05,52.57 48.05,52.21 48.37,51.89 v1(48.37,51.45) ; SW1.4 16.1,111.12 C48.1 14.54,114.36 v1(13.77,115.14) ; v1(76.45,55.49) C87.1 ; 16.21,122.86 18.66,122.86 C49.1 20.43,122.72 U6.1 ; R38.1 R37.1 R41.1 ; R35.1 R42.2 67.38,78.55 H3.2 ; 76.2,62.67 75.69,62.67 ; 62.74,67.45 63.11,67.45 64.06,68.39 U12.10 66.74,68.39 v1(66.8,68.45)
  Top Layer w0.508: v1(40.51,38.86) 47.64,38.86 50.51,41.73 71.16,41.73 72.09,40.81 72.09,36.94 79.75,29.27 79.75,26.54 78.46,25.25 ; C89.1 126.58,100.42 C88.1 ; H2.24 42.19,96.65 43.04,95.79 ; C16.2 46.63,53.3 46.63,53.37 46.84,53.58 46.84,54.08 47.12,54.36 v1(47.88,54.36) 49.4,54.36 v1(49.91,53.85) ; v1(3.18,63.12) 3.18,65.38 C44.2 3.87,66.07 R11.1 2.17,69.85 1.34,69.85 0.75,70.44 0.75,71.28 1.39,71.91 USBC1.A1B12 ; C92.1 126.58,85.76 C93.1 ; v1(47.49,46.79) 46.72,46.01 41.26,46.01 41.26,43.17 v1(40.51,42.42) ; C100.1 126.2,23.91 C101.1 ; C97.1 125.7,38.7 C96.1 ; 20.51,23.31 20.45,23.37 R5.1 ; 75.56,62.23 76.07,62.23 ; v1(51.1,46.9) C17.2 C18.2 C19.2 ; v1(72.85,62.36) 75.56,62.36 ; C24.2 53.09,108.97 51.87,110.19 51.87,113.59 52.32,114.05 54.1,114.05 58.67,118.62 CN5.2 ; v1(39.88,122.43) 39.87,122.43 U6.40 ; R38.1 64.32,32.7 C8.2 59.44,33.64 59.44,36 58.44,37 56.17,37 55.37,36.2 R6.1 ; 76.32,62.04 84.33,62.04 ; C20.2 52.2,59.57 v1(52.2,57.91) ; U9.3 2.27,29.9 2.27,29.68 2.51,29.44 2.73,29.44 3.3,28.86 C53.2 7.31,29.61 7.31,35.27 7.28,35.31 7.28,35.4 7.04,35.64 6.95,35.64 6.9,35.69 6.73,35.69 C52.2 6.35,36.07 2.82,36.07 1.66,37.22 U8.3 1.66,38.82 2.92,40.07 U10.1 ; 75.69,62.48 76.2,62.48 ; 84.31,62.74 76.46,62.74
  Top Layer w0.762: H3.2 70.82,85.93 R49.2 72.93,87.36 C40.2 v1(80.26,85.09) ; H3.2 65.99,80.52 67.37,79.13 69.84,79.13 v1(71.37,77.6) ; H3.2 65.41,82.11 v1(62.57,84.95) 62.57,86.91 C39.2 62.61,86.98 61.34,86.98 ; v1(59.88,88.95) v1(61.34,88.95) ; v1(61.34,88.95) 61.34,89.53 U4.4 ; v1(61.34,88.95) v1(61.34,87.76) 61.34,86.98 ; 61.34,86.98 C38.2 60.04,85.1 v1(59.88,84.95) ; 61.34,86.98 v1(61.34,86.27) ; C25.2 58.04,106.99 v1(58.04,105.28) ; C26.2 60.54,105.29 v1(60.53,105.28) ; v1(65.53,105.28) 65.53,106.98 C28.2
  Top Layer w1.016: 25.91,31.48 25.91,38.03 ; 25.91,31.48 26.79,32.36 26.79,37.28 C4.2 ; 25.91,31.48 25.15,30.72 25.15,29.23 25.91,28.47 ; 25.91,31.48 25.91,28.47 ; C14.2 C13.2 C12.2 C11.2 67.85,25.28 C10.2 C9.2 60.2,26.16 v1(58.55,26.16) 58.42,26.16 58.09,25.84 58.09,24.66 57.71,24.27 v1(50.26,24.27) 28.81,24.27 25.91,27.18 25.91,28.47 ; v1(50.35,30.61) 49.29,31.67 C3.2 C2.2 44.21,31.67 C7.2 44.18,31.67 C6.2 40.27,30.22 C5.2 33.91,30.22 31.27,27.58 26.79,27.58 25.91,28.47 ; 94.49,101.77 v1(94.53,101.73) ; C8.2 58.55,32.66 v1(58.55,28.7) ; C105.2 v1(87.12,101.73) ; C84.1 85.66,64.19 84.46,62.99 ; C75.2 85.78,60.59 84.33,62.04 ; 93.03,61.47 C74.2 92.96,63.88 C86.1
  Top Layer w1.524: C27.2 63.04,106.99 v1(63.04,105.28) 62.72,104.97 62.72,103.26 69.65,96.34 83.63,96.34 C30.2 C31.2 90.88,96.65 90.91,96.63 101.31,96.63 ; C106.2 94.49,101.77
  Top Layer w2.032: v1(96.27,60.86) 96.27,47.01 92.71,43.45 92.71,40.57 C55.2 ; CN1.2 5.46,8.51 5.46,8.89 2.89,11.46 2.89,20.85 3.57,21.53 4.8,21.53 8.13,24.87 8.13,33.1 9.45,34.41 9.45,35.64 11.43,37.62 D2.2 ; 93.03,61.47 C76.2 ; C54.2 92.71,81.27 96.27,77.7 v1(96.27,63.9)
  Top Layer w2.54: C54.2 101.79,93.22 131.95,93.22 ; 131.95,93.22 C89.1 135.69,95.05 C90.1 153.59,102.74 153.72,102.62 ; 131.95,93.22 131.95,91.13 C93.1 135.56,91.01 C94.1 153.54,83.31 C95.1 ; 129.77,31.05 101.98,31.05 C55.2 92.58,34.54 79.5,21.46 28.58,21.46 24.51,25.53 24.51,27.31 CN1.2 ; C103.1 153.42,21.46 C102.1 135.44,29.03 131.44,29.03 ; C99.1 153.16,40.64 C98.1 135.31,33.07 C97.1 C101.1
  Inner2 w2.032: v1(63.04,105.28) 64.09,105.28 v1(68.94,110.13) 75.67,110.13 v1(77.09,108.71) 84.07,101.73 v1(87.12,101.73) v1(94.53,101.73)
  Inner2 w2.54: v1(21.34,39.62) v1(22.48,39.62) 22.55,39.56 C4.2 37.62,39.56 38.65,40.59 49.56,40.59 65.2,56.23 65.2,60.76 71.42,66.98 75.55,66.98 C54.2
  Bottom Layer w0.508: v1(72.85,62.36) v1(77.34,62.36) v1(81.43,62.36) v1(87,62.36) 89.53,62.36 ; v1(39.88,122.43) 41.67,120.64 41.67,114.8 43.05,113.41 U15.1 ; v1(47.5,49.91) 47.49,49.9 v1(47.49,46.79) v1(49.53,46.79) ; v1(49.53,49.4) 49.53,46.79 v1(49.53,46.79) ; 89.53,62.36 C85.1 95.75,63.37 v1(96.27,63.9) ; 89.53,62.36 89.66,62.36 ; v1(49.53,46.79) 50.99,46.79 v1(51.1,46.9) 51.1,52.86 v1(51.09,52.87) 50.11,53.85 v1(49.91,53.85) 51.18,55.12 51.69,55.12 52.2,55.63 v1(52.2,57.91) ; v1(96.27,60.86) 95.67,61.47 C74.2 89.66,62.36 ; v1(40.51,38.86) v1(40.51,42.42) ; 89.66,62.36 96.26,62.36 v1(96.27,62.37)
  Bottom Layer w0.762: v1(71.37,77.6) 72.77,77.6 77.52,82.35 79.59,82.35 80.09,82.84 80.09,84.91 v1(80.26,85.09) ; v1(65.53,105.28) v1(63.04,105.28) v1(60.53,105.28) v1(58.04,105.28) 58.04,110.29 58.15,110.39 58.15,112.02 56.9,113.27 44.44,113.27 U15.1
  Bottom Layer w1.016: v1(58.55,26.16) v1(58.55,28.7) 56.44,28.7 v1(52.39,32.76) 52.39,32.65 v1(50.35,30.61)
  Bottom Layer w1.27: v1(21.34,39.62) 14,46.96 U10.1 ; v1(1.4,65.41) 1.4,63.5 v1(1.78,63.12) v1(3.18,63.12) 5.08,61.21 5.08,58.99 C4.2
  Bottom Layer w1.524: U11.1 61.5,121.32 CN5.2 67.28,110.13 v1(68.94,110.13)
  vias: v1(24.64,116.17) v1(24.64,113.28) v1(24.64,27.46) v1(26.42,36.45) v1(26.57,111.51) v1(26.67,117.73) v1(29.34,117.73) v1(29.34,111.51) v1(30.99,116.08) v1(30.99,113.26) v1(50.29,21.21) v1(51.56,85.6) v1(52.96,99.19) v1(53.34,30.61) v1(53.9,36.19) v1(54.61,30.61) v1(61.09,21.21) v1(65.41,82.42) v1(67.18,70.74) v1(67.59,64.22) v1(67.59,62.36) v1(67.59,60.27) v1(68.45,55.63) v1(69.74,55.63) v1(70.61,60.07) v1(70.99,62.36) v1(71.03,55.63) v1(72.01,56.77) v1(72.9,55.63) v1(77.91,21.21) v1(82.17,84.45) v1(83.57,53.97) v1(83.95,70.23) v1(86.87,78.74)
PVDD: length 263.4
  Top Layer w0.254: C4.1 27.83,50.37 TP1.1 ; 76.77,60.77 U12.35 ; 76.73,63.94 U12.40
  Top Layer w1.016: 76.73,63.94 79.1,63.94 79.19,63.86 83.56,63.86 84.53,64.82 84.53,64.91 C84.2 ; C75.1 84.53,59.83 84.53,60.02 83.59,60.96 79.27,60.96 79.07,60.77 76.77,60.77 ; L1.1 14.97,32.19 Q1.9
  Top Layer w2.032: C4.1 24.45,47.12 D2.1 ; C74.1 89.53,57.4 C75.1 ; C74.1 93.15,56.39 C76.1 ; C74.1 92.58,54.36 C55.1 ; C84.2 89.48,67.38 C85.2 ; C85.2 92.71,70.61 C54.1 ; C85.2 92.65,68.45 C86.2
  Top Layer w2.54: C55.1 91.69,47.06 70.4,47.06 69.24,45.9 64.26,45.9 63.03,44.66 50.8,44.66 46.78,40.64 37.85,40.64 31.43,47.06 C4.1 13.04,35.59 Q1.9
  Bottom Layer w2.032: C4.1 44.43,66.98 75.95,66.98 85.62,76.64 C54.1
PVDDLMQ: length 146.9
  Top Layer w0.254: U3.1 66.43,111.14 C28.1 65.57,110.13 U3.3 ; 51.33,33.76 50.83,33.76 v1(50.33,33.26) 50.84,32.75 U1.3
  Top Layer w0.508: v1(50.33,33.26) 50.33,33.68 C3.1
  Top Layer w1.016: v1(31.37,29.97) C5.1 41.01,35.56 C6.1 44.18,34.85 C7.1 46.66,34.87 C2.1 C3.1
  Top Layer w1.524: R4.2 v1(29.91,29.97) ; 53.09,111.89 v1(55.23,111.89) ; v1(56.38,111.89) C25.1 C26.1 C27.1 C28.1
  Bottom Layer w1.524: v1(55.23,111.89) v1(56.38,111.89) 56.81,111.46 56.81,110.95 22.23,76.37 22.23,45.3 31.43,36.1 31.43,30.04 v1(31.37,29.97) v1(29.91,29.97)
VBUS1: length 44.7
  Top Layer w0.203: 3.18,77.34 3.14,77.31 2.33,77.31 2.06,77.58 USBC1.B4A9
  Top Layer w0.254: C107.2 12.72,73.84 13.03,73.84 13.19,74.01 13.19,74.77 13.03,74.93 12.78,74.93 D4.5 ; 2.49,73.28 2.02,72.81 1.38,72.81 ; v1(13.65,78.36) 13.65,71.95 15.88,69.72 15.88,68.82 L6.2 ; v1(8.13,78.36) 4.19,78.36 3.18,77.34
  Top Layer w0.381: 2.49,73.28 7.16,73.28 8.31,72.14 11.18,72.14 12.11,73.07
  Top Layer w0.508: L6.2 15.7,69.48 12.11,73.07 C107.2
  Bottom Layer w0.254: v1(13.65,78.36) v1(8.13,78.36)
(no net):
  vias: v1(4.95,81.91)
A+: length 73.4
  Top Layer w0.508: L8.2 123.06,102.84 C88.2
  Top Layer w1.778: L7.2 123.5,109.09 C89.2 142.95,117.55 C90.2 153.67,117.98 C91.2 156.08,115.57 156.08,98.04 CN2.2
A-: length 75
  Top Layer w0.508: C92.2 123.06,83.3 L10.2
  Top Layer w1.778: L10.2 122.81,77.52 C93.2 142.82,68.51 143.26,68.07 153.54,68.07 C95.2 156.72,71.25 156.72,87.25 CN2.1
B+: length 73.9
  Top Layer w0.508: 123.06,39.54 123.06,40.73 L12.2
  Top Layer w1.778: L12.2 122.23,46.48 C97.2 142.57,55.57 C98.2 153.16,55.88 156.34,52.7 156.34,36.83 CN3.2
B-: length 74.9
  Top Layer w0.508: L14.2 123.06,21.12 C100.2
  Top Layer w1.778: CN3.1 156.34,25.4 156.34,9.14 C103.2 153.42,6.22 C102.2 142.69,6.53 C101.2 131.32,6.86 122.74,15.44 L14.2
DN: length 11.2
  Top Layer w0.254: 1.24,75.46 0.68,75.46 0.46,75.24 0.46,74.65 0.66,74.45 1.37,74.45 1.38,74.46 2.83,74.46 2.91,74.39 10.08,74.39
DP: length 10.6
  Top Layer w0.254: 2.31,75.73 2.32,75.72 2.32,75.17 2.31,75.17 2.31,75.16 2.11,74.96 1.38,74.96 ; 2.31,75.73 2.88,76.29 10.08,76.29 ; 2.31,75.73 2.08,75.96 1.38,75.96
DSP_RESET: length 72.9
  Top Layer w0.254: U6.24 33.8,104.53 33.8,96.15 33.02,95.38 31.88,95.38 31.12,94.61 31.12,93.6 31.92,92.8 31.92,82.91 18.67,69.66 18.67,57.4 13.23,51.96 U10.3
DSP_SCL: length 63.8
  Top Layer w0.254: v1(36.45,100.84) 36.45,102.06
  Inner2 w0.254: U10.5 4.13,55.75 5.21,55.75 38.59,89.13 38.59,97.17 36.45,99.31 v1(36.45,100.84)
DSP_SDA: length 63.9
  Top Layer w0.254: v1(37.92,100.81) 37.97,100.86 37.97,102.06
  Inner2 w0.254: v1(37.92,100.81) 37.97,100.76 37.97,99.44 39,98.41 39,88.97 4.62,54.59 3.05,54.59 U10.4
DSP_SELFBOOT: length 85.5
  Top Layer w0.254: U10.6 1.93,59.46 1.6,59.13 1.6,50.98 1.78,50.8 2.42,50.8 2.43,50.78 3.41,50.78 4.13,51.51 13.42,51.51 19.13,57.21 19.13,69.47 33.8,84.14 33.8,94.88 34.29,95.38 35.56,95.38 36.2,96.01 36.2,97.28 35.18,98.3 U6.25
ENABLE_3.3V: length 46.2
  Top Layer w0.254: 77.45,79.91 75.48,81.88 R10.1 75.44,82.26 72.63,82.26 72.47,82.09 70.53,82.09 70.15,82.47 v1(69.34,82.47)
  Inner2 w0.254: U15.4 69.34,85.6 v1(69.34,82.47)
ENABLE_12V: length 60.9
  Top Layer w0.254: U15.8 45.59,85.33 42.43,82.16 42.43,64.75 45.59,61.58 45.59,54.11 R7.1 43.01,51.06 43.76,50.31 46.02,50.31 U2.13
ESP_TAS_ADR: length 9.7
  Top Layer w0.254: U6.20 28.83,100.71 H2.14
GOOD_13.2V: length 76.3
  Top Layer w0.254: U1.14 52.14,34.87 R1.1 51.65,35.27 v1(50.66,35.27)
  Inner1 w0.254: v1(50.66,35.27) 50.66,46.51 50.51,46.67 50.51,101.89 U15.6
INA+: length 26.7
  Top Layer w0.254: C57.1 45.22,72.52 44.96,72.26 44.96,67.57 47.7,64.84 63.16,64.84 63.54,65.21 U12.15
INA-: length 31.2
  Top Layer w0.254: U12.16 65,64.62 63.66,64.62 63.49,64.44 63.46,64.44 63.44,64.42 63.4,64.42 63.35,64.38 47.51,64.38 44.41,67.48 44.41,71.02 44.38,71.05 44.38,73.98 44.41,74.01 44.41,75.27 45.08,75.95 45.44,75.95 C58.1
INB+: length 52.1
  Top Layer w0.254: U12.25 66.36,58.86 67.18,58.04 67.18,56.5 66.43,55.75 63.24,55.75 62.3,54.81 53.02,54.81 42.88,64.94 42.88,79.33 45.53,81.98 C60.1
INB-: length 46.3
  Top Layer w0.254: U12.26 66.35,58.23 66.73,57.85 66.73,56.69 66.37,56.34 63.06,56.34 62.11,55.39 53.08,55.39 43.34,65.13 43.34,77.63 44.89,79.18 45.38,79.18 C59.1
L_CKI: length 88.3
  Top Layer w0.254: R17.1 40.95,108.18 v1(39.8,109.32) ; U8.2 v1(3.26,39.23)
  Inner2 w0.254: v1(3.26,39.23) 3.9,39.87 3.9,40.31 39.8,76.21 v1(39.8,109.32)
L_SDI: length 88.3
  Top Layer w0.254: R18.1 41.02,106.73 v1(41.02,105.66) ; v1(4.95,39.24) 4.86,39.15 U8.1
  Inner2 w0.254: v1(4.95,39.24) 7.48,39.24 43.69,75.45 43.69,95.57 41.45,97.8 41.45,98.29 41.83,98.67 41.83,99.17 42.18,99.52 42.18,103.55 41.92,103.8 41.92,104.76 v1(41.02,105.66)
LRCK: length 4.5
  Top Layer w0.254: U11.4 83.41,116.92 R34.2
MCLK: length 4.5
  Top Layer w0.254: U11.3 80.91,116.89 R31.2
OUTA+: length 80.8
  Top Layer w0.254: v1(76.48,65) 76.06,64.58 v1(76,64.58) ; C72.1 83.55,67.18 v1(83.56,67.19) ; TP20.1 107.31,112.68 L8.1
  Top Layer w0.381: v1(76,64.58) U12.41 74.39,64.57 v1(72.8,64.57) v1(72.14,64.57)
  Bottom Layer w1.016: v1(76,64.58) 78.61,67.19 v1(83.56,67.19)
  Bottom Layer w1.778: 86.67,67.19 107.11,87.64 ; 86.67,67.19 v1(83.56,67.19) ; 86.67,67.19 86.87,67.19 ; 107.31,87.64 L8.1
OUTA-: length 54
  Top Layer w0.254: C73.1 83.53,65.19 v1(83.56,65.22) ; L10.1 107.28,73.76 TP22.1 ; v1(72.13,63.34) v1(72.13,62.73)
  Top Layer w0.381: v1(72.13,63.34) v1(72.8,63.34) 72.83,63.31 U12.39 75.98,63.31 v1(76,63.32)
  Bottom Layer w1.016: v1(76,63.32) 76.66,63.32 78.56,65.22 v1(83.56,65.22)
  Bottom Layer w1.524: L10.1 94.98,65.22 v1(83.56,65.22)
OUTB+: length 53.2
  Top Layer w0.254: TP24.1 107.31,50.29 L12.1 ; v1(83.57,59.62) 83.56,59.63 C83.1
  Top Layer w0.381: v1(72.13,61.95) v1(72.13,61.33) 72.74,61.33 v1(72.8,61.39) 74.39,61.39 U12.36 75.97,61.4 v1(76,61.38)
  Bottom Layer w1.016: v1(76,61.38) 76.01,61.37 76.5,61.37 78.25,59.62 v1(83.57,59.62)
  Bottom Layer w1.524: L12.1 94.18,59.62 v1(83.57,59.62)
OUTB-: length 79.4
  Top Layer w0.254: v1(83.57,57.66) 83.56,57.65 C82.1 ; TP26.1 107.38,17.72 L14.1
  Top Layer w0.381: v1(76.48,59.66) 76.46,59.66 v1(76,60.12) 75.98,60.13 U12.34 72.84,60.13 v1(72.8,60.1) v1(72.14,60.1)
  Bottom Layer w1.016: v1(76,60.12) 78.46,57.66 v1(83.57,57.66)
  Bottom Layer w1.778: v1(83.57,57.66) 86.11,57.66 107.5,36.26 107.5,15.56 L14.1
RXD: length 39.3
  Top Layer w0.254: v1(39.5,117.35) 38.22,117.35 U6.36 ; TP11.1 14.73,93.98 H2.5
  Bottom Layer w0.254: v1(39.5,117.35) 37.85,117.35 18.27,97.78 18.27,96.18 17.61,95.52 16.02,95.52 H2.5
SCL: length 65.7
  Top Layer w0.254: v1(68.71,72.78) 69.29,72.2 U12.53 79.18,72.2 79.88,71.5 R22.1 ; U6.26 36.45,103 ; 36.45,103 37.08,102.37 37.08,100.83 39.43,98.48 41.61,98.48 v1(42.04,98.04) ; 36.45,103 R20.2
  Inner2 w0.254: v1(42.04,98.04) 58.42,81.66 68.45,81.66 69.07,81.04 69.07,80.05 68.71,79.69 v1(68.71,72.78)
SCLK: length 4.5
  Top Layer w0.254: R32.2 85.91,116.88 U11.5
SDA: length 71
  Top Layer w0.254: R19.2 37.97,105.68 U6.27 38.79,105.35 38.79,101.01 40.86,98.93 v1(42.42,98.93) ; v1(69.6,72.9) 69.66,72.83 U12.54 76.92,72.83 77.1,72.66 79.67,72.66 R21.2
  Inner2 w0.254: v1(42.42,98.93) 57.46,83.9 66.86,83.9 69.26,81.5 69.87,81.5 70.02,81.65 70.95,81.65 71.61,80.99 71.61,80.05 70.95,79.39 70.5,79.39 69.6,78.49 v1(69.6,72.9)
SDIN: length 4.4
  Top Layer w0.254: U11.6 88.41,116.91 R33.2
SDOUT: length 20.2
  Top Layer w0.254: R48.2 77.34,70.56 77.34,70.48 76.97,70.1 v1(76.12,70.1)
  Bottom Layer w0.254: v1(76.12,70.1) 74.56,70.1 72.89,68.43 71.11,68.43 70.23,69.3 70.23,80.26 H3.4
TAS_ADR: length 89.4
  Top Layer w0.254: v1(64.52,77.6) R42.1 66.68,76.79 66.68,74.72 66.91,74.48 66.91,73.75 69.49,71.17 69.49,69.58 71.32,67.75 U12.46
  Inner1 w0.254: v1(64.52,77.6) 64.44,77.52 63.45,77.52 50.96,90.01 50.96,103.03 45.92,108.08 45.09,108.08 44.34,107.33 44.34,97.93 38.74,92.33 26.54,92.33 H2.13
TAS_CLIP: length 98.7
  Top Layer w0.254: R43.1 70.87,56.77 v1(69.75,56.77) ; R43.1 73.67,52.42 LED2.2 ; R43.1 74.4,54.71 U12.29 ; v1(67.82,68.58) 69.74,66.66 v1(69.74,62.63)
  Bottom Layer w0.254: v1(67.82,68.58) 67.82,71.97 63.93,75.85 63.93,76.02 57.91,82.04 57.91,88.33 56.82,89.42 56.82,89.9 57.16,90.25 60.02,90.25 66.42,96.65 66.42,108.52 54.55,120.4 U14.4 ; v1(69.75,56.77) 69.75,62.63 v1(69.74,62.63)
TAS_FAULT: length 100.3
  Top Layer w0.254: 66.73,50.93 65.33,52.32 65.15,52.32 ; 66.73,50.93 v1(63.5,50.93) ; 66.73,50.93 R44.1 69.61,50.62 LED1.1 ; U12.28 65.03,56.95 v1(63.47,56.95)
  Inner2 w0.254: v1(63.47,56.95) 63.47,56.77 63.42,56.71 62.22,56.71 62.22,57.83 63.14,58.76 63.14,61.61 65.89,64.36 65.89,68.36 70.21,72.68 70.21,73.2 72.49,75.49 72.49,90.4 71.69,91.2 71.69,91.97 62.55,101.12 62.55,102.6 61.24,103.9 61.24,109.19 56,114.43 45.72,114.43 45.47,114.68 U14.8
  Bottom Layer w0.254: v1(63.5,50.93) 63.5,56.92 v1(63.47,56.95)
TAS_MUTE: length 78.1
  Top Layer w0.254: U14.2 49.28,122.94 TP19.1 ; v1(64.52,76.09) 64.54,76.07 R35.2 65.74,75.95 65.74,75.01 66.46,74.29 66.46,73.56 69.04,70.98 69.04,69.39 71.31,67.12 U12.45
  Inner1 w0.254: v1(64.52,76.09) 64.52,76.78 64.53,76.8 64.54,76.8 65.1,77.35 65.1,77.84 64.76,78.18 64.76,79.25 63.99,80.02 63.99,81.48 61.93,83.55 61.93,92.89 47.68,107.14 47.68,121.41 46.13,122.96 45.49,122.96 U14.2
TAS_RESET: length 101.2
  Top Layer w0.254: v1(62.81,48.42) 64.37,48.42 R45.1 65.12,47.83 TP29.1 ; U12.27 62.81,57.59 v1(62.8,57.59)
  Inner2 w0.254: U14.6 54.99,117.86 61.7,111.15 61.7,104.73 62.49,103.94 68.09,103.94 72.3,99.73 72.3,92.88 73.41,91.77 73.41,73.85 70.31,70.75 70.31,70.07 66.69,66.44 66.69,65.99 66.34,65.65 66.34,64.17 63.6,61.43 63.6,58.39 v1(62.8,57.59)
  Bottom Layer w0.254: v1(62.8,57.59) 62.8,48.43 v1(62.81,48.42)
TXD: length 45.5
  Top Layer w0.254: v1(39.5,118.61) 38.23,118.61 U6.37 ; TP10.1 H2.3
  Bottom Layer w0.254: v1(39.5,118.61) 36.57,118.61 31.57,113.61 31.57,112.91 16.43,97.78 14.14,97.78 13.48,97.11 13.48,95.52 H2.3
USBD+: length 40.7
  Top Layer w0.254: R15.1 17.86,105.03 10.62,97.79 8.12,97.79 7.33,97 7.33,94.26 8.4,93.2 8.4,90.41 10.67,88.14 10.67,87.51 7.51,84.35 7.51,84 13.06,78.44 13.06,76.98 D4.6
USBD-: length 40.9
  Top Layer w0.254: R16.2 17.73,107.22 17.69,107.18 16.05,107.18 6.93,98.06 6.93,84.01 11.35,79.58 11.35,75.06 12.02,74.39 D4.4
$1N618: length 1.8
  Top Layer w0.254: U1.10 55.27,32.75 C8.1
$1N622: length 4.2
  Top Layer w0.254: U1.7 52.64,27.48 L2.2
$1N4748: length 15
  Top Layer w0.254: 45.79,48.99 45.74,49.05 45.02,49.05 44.89,48.91 43.76,48.91 43.62,49.05 C22.1 ; 41.35,48.96 41.35,47.55 41.53,47.37 46.51,47.37 46.96,47.82 U2.16
  Top Layer w0.508: L3.1 41.1,49.21
$1N5004: length 1.5
  Top Layer w0.254: C16.1 45.74,49.59 45.79,49.64
$1N14331: length 5.7
  Top Layer w0.254: U1.11 53.91,33.25 54.17,33.51 54.17,33.88 54.98,34.69 R6.2 56.75,34.69 R3.1 57.96,34.68 C1.1
$1N15560: length 8.7
  Top Layer w0.508: R5.2 15.87,23.35 R2.1 14.46,24.63 14.46,26.03 14.95,26.52 14.95,28.66
$1N16223: length 5.5
  Top Layer w2.54: F1.1 5.64,13.51 CN1.1
$1N16230: length 12.7
  Top Layer w1.016: 13.68,28.66 11.14,28.66 11.19,28.61 D1.1
  Top Layer w2.54: D1.1 11.19,19.81 F1.2
$1N16569: length 2.1
  Top Layer w1.016: L1.2 21.06,29.46 R4.1
$2N991: length 2.1
  Top Layer w0.254: C29.1 71.66,110.13 U3.10
$2N992: length 6.6
  Top Layer w0.254: U3.7 69.19,108.01
  Top Layer w0.762: L4.2 69.19,104.8 69.19,108.01
$2N997: length 5.6
  Top Layer w0.254: C23.1 74.72,111.77 R8.1 R9.2 70.62,110.63 U3.11
$2N6924: length 45.9
  Top Layer w0.254: R8.2 74.72,113.28 C23.2 75.13,112.94 75.61,112.47 75.61,111.74 75.44,111.57 75.17,111.57 74.47,110.87 74.39,110.87 74.23,110.71 74.23,108.75 77.17,105.81 78.18,105.81 C36.2 78.49,104.34 L4.1
  Top Layer w1.524: D5.1 101.31,102.86 C35.1 C34.1 C33.1 C32.1 90.88,99.69 C31.1 C30.1 80.51,103.12 L4.1
$3N1164: length 6.1
  Top Layer w0.254: 61.23,90.76 61.54,91.07 61.81,91.07 61.97,91.24 61.97,91.51 62.27,91.8 C37.2
  Top Layer w0.762: 64.02,92.08 62.63,90.69 61.14,90.69
$3N1261: length 1.3
  Top Layer w0.254: U4.6 61.43,91.91 C37.1
$4N1079: length 8.9
  Top Layer w0.254: 1.38,76.96 1.48,76.86 9.21,76.86 9.7,77.35 9.7,77.48 R13.1
$4N1568: length 18.2
  Top Layer w0.254: U6.3 19.31,119.89 17.92,118.5 SW1.2 14.7,117.44 13.14,115.89 C48.2 TP9.1
$4N2917: length 1.9
  Top Layer w0.254: C47.2 9.8,117.15 SW1.1
$4N2919: length 2
  Top Layer w0.254: SW1.3 9.8,113.23 C47.1
$4N2955: length 1.8
  Top Layer w0.254: C51.2 51.49,100.25 SW2.2
$4N2957: length 1.9
  Top Layer w0.254: C51.1 51.49,95.84 SW2.4
$4N2996: length 10.8
  Top Layer w0.254: 43.04,100.29 43.01,100.33 TP12.1 39.93,101.04 39.42,101.04 39.24,101.22 39.24,106.49 39.08,106.65 38.76,106.65 U6.28
$4N3000: length 20.6
  Top Layer w0.254: R14.2 2.22,81.23 C45.2 2.17,79.55 2.15,79.54
  Bottom Layer w0.254: 6.33,70.89 2.15,70.89 2.15,71.56 1.85,71.86 1.85,78.44 2.15,78.74 2.15,79.54 6.33,79.54
$4N3546: length 4.9
  Top Layer w0.254: C46.2 13.17,65.43
  Top Layer w0.508: D3.1 15.67,65.43 L6.1
$4N5397: length 19.7
  Top Layer w0.254: v1(19.43,118.62) 20.71,118.62 U6.4
  Bottom Layer w0.254: v1(19.43,118.62) 10.9,110.09 U7.3
$4N5403: length 20.2
  Top Layer w0.254: v1(19.43,117.32) 20.68,117.32 U6.5
  Bottom Layer w0.254: v1(19.43,117.32) 9.7,107.59 U7.4
$4N5413: length 20.7
  Top Layer w0.254: v1(19.43,116.04) 19.47,116.08 U6.6
  Bottom Layer w0.254: U7.5 8.47,105.09 v1(19.43,116.04)
$4N5420: length 21.2
  Top Layer w0.254: U6.7 20.71,114.81 v1(19.43,114.81)
  Bottom Layer w0.254: v1(19.43,114.81) 7.21,102.59 U7.6
$4N5498: length 25.2
  Top Layer w0.254: U6.8 20.71,113.55 v1(19.43,113.55)
  Bottom Layer w0.254: v1(19.43,113.55) 3.16,97.28 H1.1
$4N5502: length 25.9
  Top Layer w0.254: v1(19.43,112.28) 20.7,112.28 U6.9
  Bottom Layer w0.254: v1(19.43,112.28) 2.29,95.14 H1.2
$4N5507: length 27.3
  Top Layer w0.254: U6.10 20.71,111.01 v1(19.43,111.01)
  Bottom Layer w0.254: v1(19.43,111.01) 3.67,95.25 3.67,93.33 2.54,92.2 H1.3
$4N5512: length 28.5
  Top Layer w0.254: v1(19.43,109.73) 20.71,109.73 U6.11
  Bottom Layer w0.254: H1.4 4.32,91.69 4.32,94.62 v1(19.43,109.73)
$4N5878: length 10.2
  Top Layer w0.254: H2.12 27.56,101.98 U6.19
$4N5890: length 9.2
  Top Layer w0.254: H2.16 30.1,99.44 U6.21
$4N5979: length 12.6
  Top Layer w0.254: H2.6 19.18,101.22 20.65,101.22 23.75,104.32 U6.16
$4N6002: length 10.7
  Top Layer w0.254: U6.18 26.29,103.25 H2.10
$4N6037: length 8.6
  Top Layer w0.254: U6.22 31.37,98.17 H2.18
$4N6293: length 4.9
  Top Layer w0.254: U6.34 42.42,114.81 42.93,115.32
$4N6299: length 5.4
  Top Layer w0.254: U6.35 41.15,116.08 42.93,117.86
$4N6321: length 4.9
  Top Layer w0.254: U6.38 42.42,119.89 42.93,120.4
$4N6327: length 5.4
  Top Layer w0.254: 42.93,122.94 41.15,121.16 U6.39
$4N6557: length 26.6
  Top Layer w0.254: v1(19.43,108.43) 20.68,108.43 U6.12
  Bottom Layer w0.254: v1(19.43,108.43) 19.43,105.61 10.94,97.11 10.94,93.64 11.6,92.98 16.02,92.98 H2.7
$4N12444: length 2.5
  Top Layer w0.508: U8.6 4.86,30.68 U9.1
$4N12449: length 2.5
  Top Layer w0.508: U8.5 3.26,30.68 U9.2
$4N27607: length 2
  Top Layer w0.254: R16.1 20.69,107.22 U6.13
$4N27651: length 2
  Top Layer w0.254: R15.2 20.71,105.92 U6.14
$4N27686: length 13.7
  Top Layer w0.254: H2.4 17.91,102.49 20.33,102.49 U6.15
$4N27698: length 11.8
  Top Layer w0.254: U6.17 25.2,104.46 25.2,104.07 21.21,100.08 20.57,100.08 H2.8
$4N27768: length 8.1
  Top Layer w0.254: H2.20 32.39,104.39 U6.23
$4N29432: length 8.9
  Top Layer w0.254: 1.38,73.96 2.69,73.96 2.72,73.93 8.79,73.93 R12.1
$4N30882: length 6.6
  Top Layer w0.254: U6.33 38.86,113.54 U15.3
$4N30886: length 8
  Top Layer w0.254: U15.5 43.18,106.93 43.18,107.62 41.92,108.88 41.92,109.24 38.8,112.37 38.31,112.37 U6.32
$4N30891: length 9.3
  Top Layer w0.254: U6.31 39.15,111 41.51,108.65 41.51,106.76 43.05,105.21 U15.7
$4N30898: length 2.6
  Top Layer w0.254: U6.30 38.42,109.73 38.97,109.19 39.08,109.19 39.24,109.03 39.24,108.91 40.08,108.08
$4N30902: length 2.6
  Top Layer w0.254: 40.08,106.81 39.24,107.64 39.24,107.76 39.08,107.92 38.97,107.92 38.42,108.46 U6.29
$5N1135: length 56
  Top Layer w0.254: 80.87,115.99 80.91,115.95 v1(80.91,115.05) TP14.1 ; v1(70.89,70.31) 70.9,70.29 U12.50
  Bottom Layer w0.254: v1(70.89,70.31) 82.8,82.22 82.8,113.15 v1(80.91,115.05)
$5N1139: length 55.5
  Top Layer w0.254: U12.49 74.39,69.65 v1(72.16,69.65) ; 85.89,115.99 v1(85.89,115.05) 85.89,113.84 TP15.1
  Bottom Layer w0.254: v1(72.16,69.65) 85.89,83.37 v1(85.89,115.05)
$5N1144: length 56.5
  Top Layer w0.254: R33.1 v1(88.39,115.03) 88.39,113.89 TP16.1 ; v1(72.64,69.01) 72.66,69.02 U12.48
  Bottom Layer w0.254: v1(72.64,69.01) 88.39,84.76 v1(88.39,115.03)
$5N1149: length 56.5
  Top Layer w0.254: 83.34,115.99 v1(83.34,115.05) 83.34,113.99 TP17.1 ; v1(71.2,69.16) 71.97,68.39 U12.47
  Bottom Layer w0.254: v1(83.34,115.05) 83.34,81.82 71.2,69.67 v1(71.2,69.16)
